# Altium project FMC_ADC.PrjPcb (part 1 of 4)
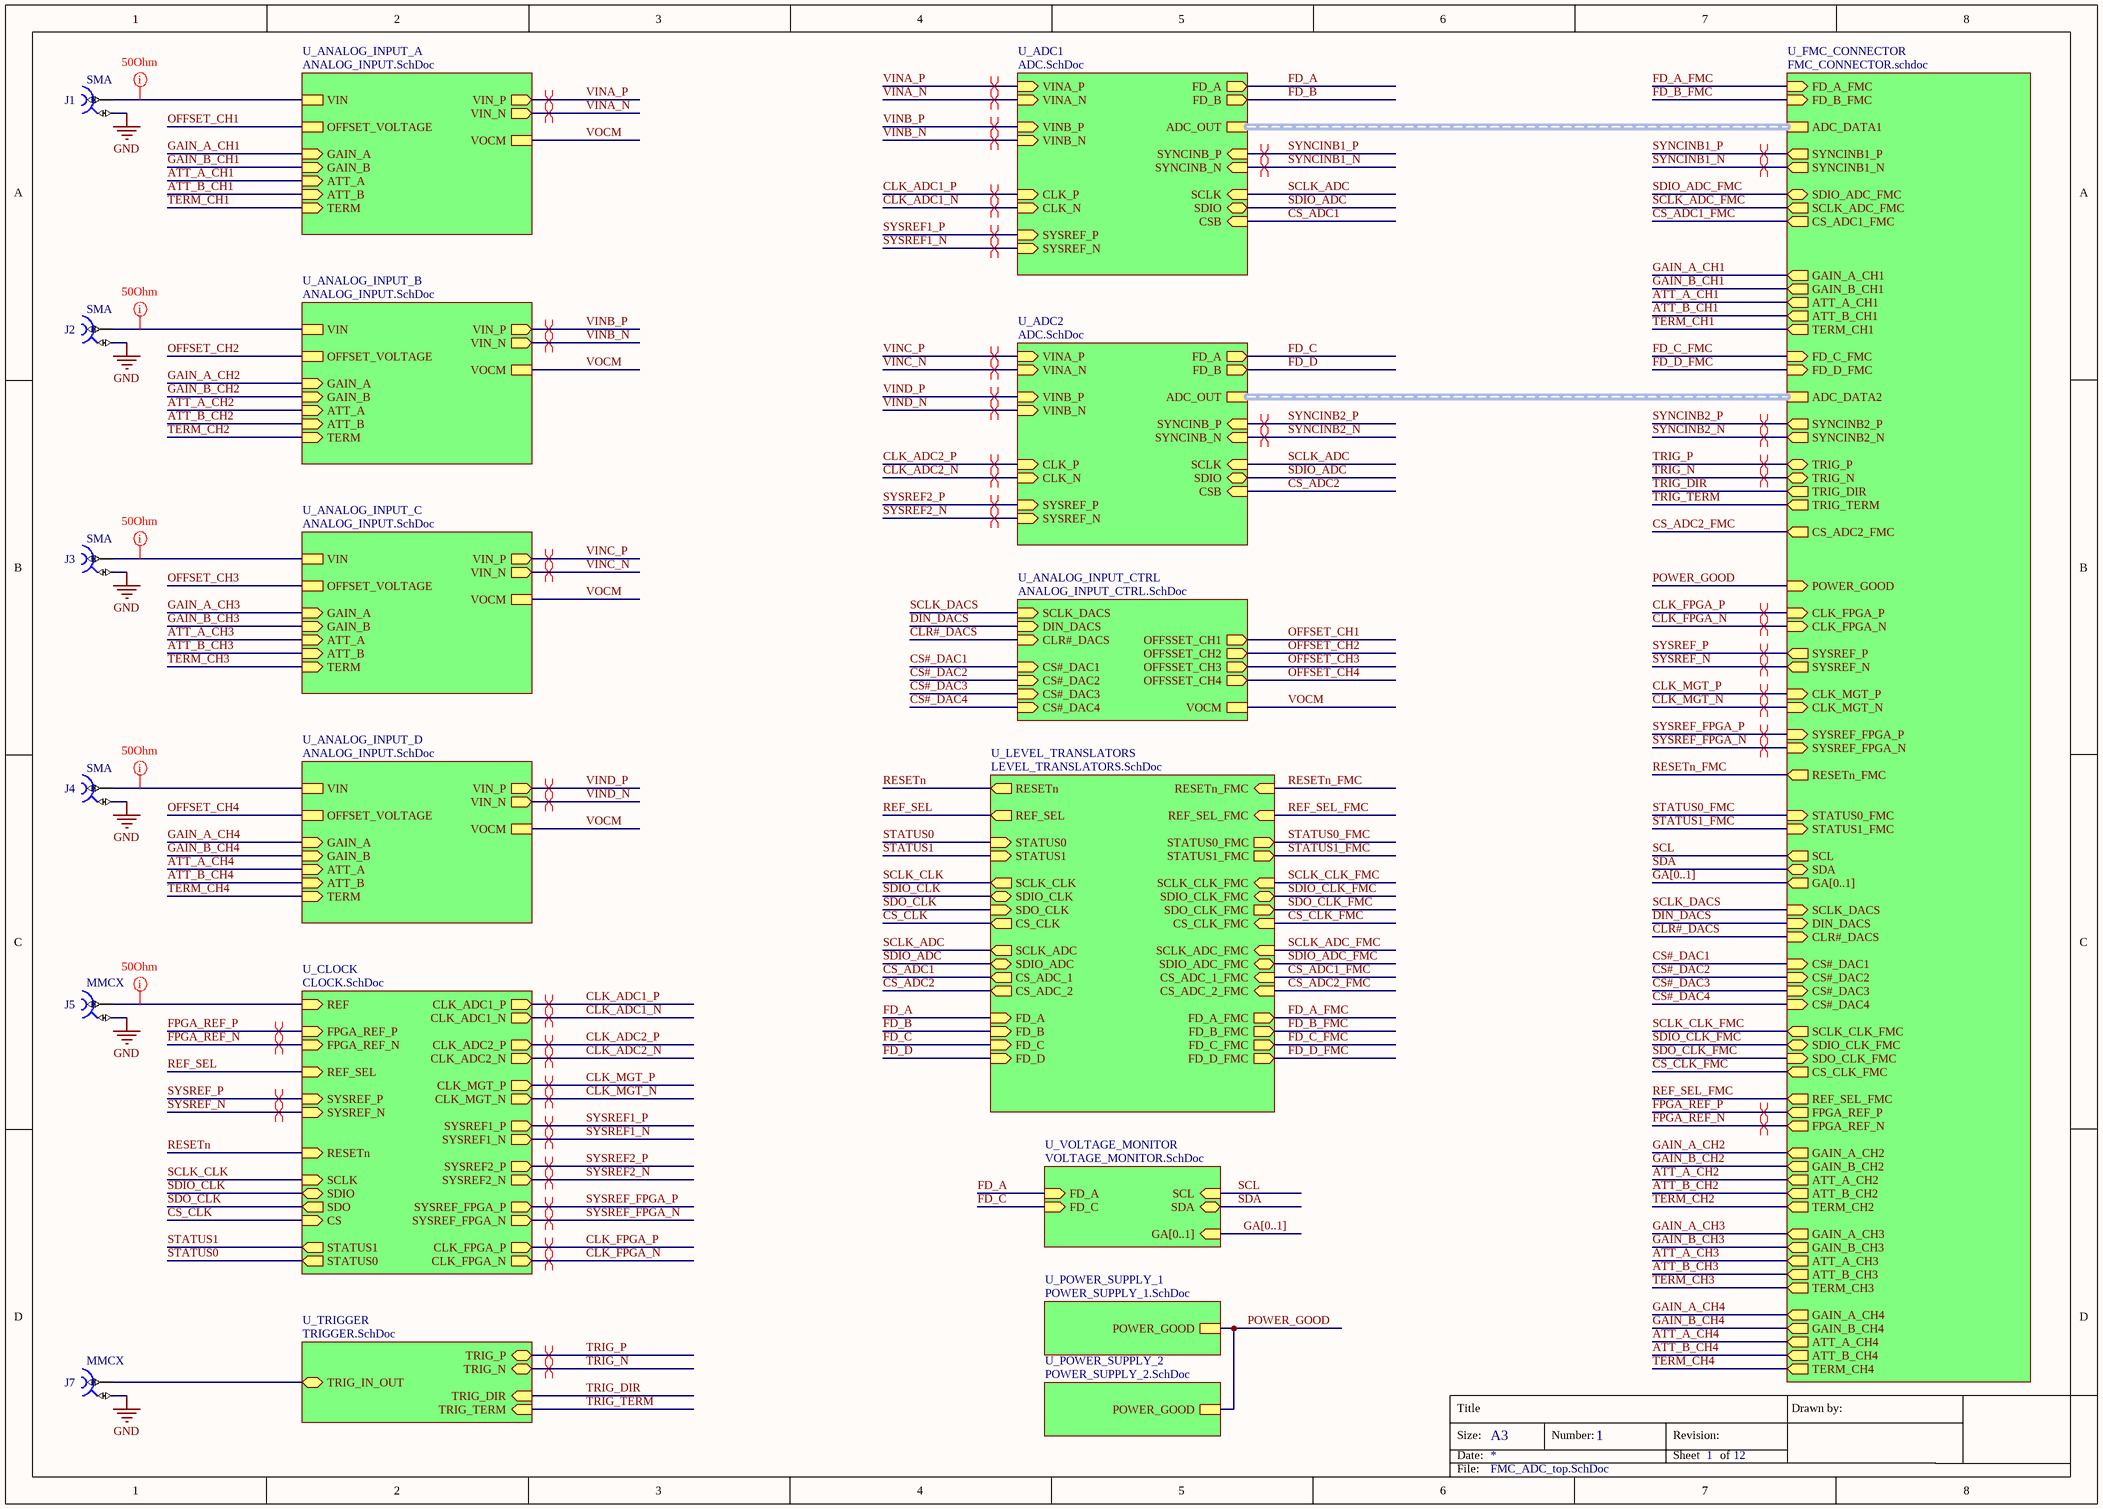
[diagram p0: FMC_ADC_top.SchDoc]
ProjectAddress1: Nowowiejska 15/19; ProjectAuthor: Wojciech Ruc³o; ProjectOrganization: Warsaw Univeristy of Technology; ProjectRevision: 1.0; ProjectTitle: FMC ADC 1G 4CH
12 sheets, 553 parts. Net scope: hierarchical (ports join the sheet entries above them; power ports are global).
Board file: FMC_ADC_Single.PCBDOC
Sheets:
  FMC_ADC_top.SchDoc
    U_FMC_CONNECTOR = FMC_CONNECTOR.schdoc
      U_CON_FMC_400PIN = CON_FMC_400PIN.SchDoc
    U_ADC2 = ADC.SchDoc
    U_CLOCK = CLOCK.SchDoc
    U_POWER_SUPPLY_1 = POWER_SUPPLY_1.SchDoc
    U_ANALOG_INPUT_D = ANALOG_INPUT.SchDoc
    U_ADC1 = ADC.SchDoc
    U_ANALOG_INPUT_C = ANALOG_INPUT.SchDoc
    U_ANALOG_INPUT_B = ANALOG_INPUT.SchDoc
    U_ANALOG_INPUT_A = ANALOG_INPUT.SchDoc
    U_LEVEL_TRANSLATORS = LEVEL_TRANSLATORS.SchDoc
    U_POWER_SUPPLY_2 = POWER_SUPPLY_2.SchDoc
    U_VOLTAGE_MONITOR = VOLTAGE_MONITOR.SchDoc
    U_TRIGGER = TRIGGER.SchDoc
    U_ANALOG_INPUT_CTRL = ANALOG_INPUT_CTRL.SchDoc

## Sheet FMC_ADC_top.SchDoc: =ProjectTitle
size A3; Author: Wojciech Ruc³o; Organization: Warsaw Univeristy of Technology; Address1: Nowowiejska 15/19; DocumentNumber: 1; Revision: 1.0; SheetNumber: 1; SheetTotal: 12

### Parts
J1  SMA  [HUBER-SUHNER_85_SMA-50-0-101/111_NE]
J2  SMA  [HUBER-SUHNER_85_SMA-50-0-101/111_NE]
J3  SMA  [HUBER-SUHNER_85_SMA-50-0-101/111_NE]
J4  SMA  [HUBER-SUHNER_85_SMA-50-0-101/111_NE]
J5  Family: MMCX  [HUBER-SUHNER_85_MMCX-50-0-1/111_OE]  (hidden comment: Coax_1Female_1Shield)
J7  Family: MMCX  [HUBER-SUHNER_85_MMCX-50-0-1/111_OE]  (hidden comment: Coax_1Female_1Shield)

### Sub-sheets
U_ADC1 = ADC.SchDoc: ADC_OUT (harness ADC_OUT), FD_A (out), FD_B (out), VINB_P (in), VINB_N (in), VINA_N (in), VINA_P (in), CLK_P (in), CLK_N (in), SYNCINB_N (in), SYSREF_P (in), SYNCINB_P (in), SYSREF_N (in), SDIO (bidir), SCLK (in), CSB (in)
U_ADC2 = ADC.SchDoc: ADC_OUT (harness ADC_OUT), FD_A (out), FD_B (out), VINB_P (in), VINB_N (in), VINA_N (in), VINA_P (in), CLK_P (in), CLK_N (in), SYNCINB_N (in), SYSREF_P (in), SYNCINB_P (in), SYSREF_N (in), SDIO (bidir), SCLK (in), CSB (in)
U_ANALOG_INPUT_A = ANALOG_INPUT.SchDoc: VIN_P (out), VIN_N (out), VIN, OFFSET_VOLTAGE, VOCM, GAIN_A (in), GAIN_B (in), ATT_B (in), ATT_A (in), TERM (in)
U_ANALOG_INPUT_B = ANALOG_INPUT.SchDoc: VIN_P (out), VIN_N (out), VIN, OFFSET_VOLTAGE, VOCM, GAIN_A (in), GAIN_B (in), ATT_B (in), ATT_A (in), TERM (in)
U_ANALOG_INPUT_C = ANALOG_INPUT.SchDoc: VIN_P (out), VIN_N (out), VIN, OFFSET_VOLTAGE, VOCM, GAIN_A (in), GAIN_B (in), ATT_B (in), ATT_A (in), TERM (in)
U_ANALOG_INPUT_CTRL = ANALOG_INPUT_CTRL.SchDoc: OFFSSET_CH1 (out), OFFSSET_CH2 (out), OFFSSET_CH3 (out), OFFSSET_CH4 (out), DIN_DACS (in), CS#_DAC1 (in), SCLK_DACS (in), CLR#_DACS (in), CS#_DAC2 (in), CS#_DAC3 (in), CS#_DAC4 (in), VOCM
U_ANALOG_INPUT_D = ANALOG_INPUT.SchDoc: VIN_P (out), VIN_N (out), VIN, OFFSET_VOLTAGE, VOCM, GAIN_A (in), GAIN_B (in), ATT_B (in), ATT_A (in), TERM (in)
U_CLOCK = CLOCK.SchDoc: REF (in), RESETn (in), SCLK (in), SDIO (bidir), CLK_FPGA_P (out), CLK_FPGA_N (out), CS (in), STATUS0 (out), STATUS1 (out), CLK_ADC1_P (out), CLK_ADC1_N (out), CLK_ADC2_P (out), CLK_ADC2_N (out), SDO (out), FPGA_REF_P (in), FPGA_REF_N (in), SYSREF_P (in), REF_SEL (in), SYSREF_N (in), SYSREF2_P (out), SYSREF1_P (out), SYSREF2_N (out), SYSREF1_N (out), SYSREF_FPGA_P (out), SYSREF_FPGA_N (out), CLK_MGT_N (out), CLK_MGT_P (out)
U_FMC_CONNECTOR = FMC_CONNECTOR.schdoc: ADC_DATA1 (harness ADC_OUT), SDIO_ADC_FMC (bidir), FD_A_FMC (in), SCLK_ADC_FMC (out), CS_ADC1_FMC (out), FD_B_FMC (in), SYSREF_P (out), SYSREF_N (out), CLK_MGT_P (in), SYSREF_FPGA_P (in), SYSREF_FPGA_N (in), CLK_MGT_N (in), SYNCINB1_P (out), SYNCINB1_N (out), SYNCINB2_N (out), SYNCINB2_P (out), ADC_DATA2 (harness ADC_OUT), STATUS0_FMC (in), RESETn_FMC (out), STATUS1_FMC (in), CS_CLK_FMC (out), FD_C_FMC (in), FD_D_FMC (in), CS_ADC2_FMC (out), CLK_FPGA_N (in), CLK_FPGA_P (in), SCL (out), SDA (bidir), GA[0..1] (out), TRIG_DIR (out), TRIG_P (bidir), TRIG_TERM (out), TRIG_N (bidir), CS#_DAC1 (in), SCLK_DACS (in), DIN_DACS (in), CLR#_DACS (in), CS#_DAC2 (in), CS#_DAC3 (in), CS#_DAC4 (in), SDIO_CLK_FMC (bidir), SCLK_CLK_FMC (out), SDO_CLK_FMC (in), REF_SEL_FMC (out), FPGA_REF_P (out), FPGA_REF_N (out), GAIN_A_CH1 (out), GAIN_B_CH1 (out), ATT_A_CH1 (out), ATT_B_CH1 (out), TERM_CH1 (out), GAIN_A_CH2 (out), GAIN_B_CH2 (out), ATT_A_CH2 (out), ATT_B_CH2 (out), TERM_CH2 (out), GAIN_A_CH3 (out), GAIN_B_CH3 (out), ATT_A_CH3 (out), ATT_B_CH3 (out), TERM_CH3 (out), GAIN_A_CH4 (out), GAIN_B_CH4 (out), ATT_A_CH4 (out), ATT_B_CH4 (out), TERM_CH4 (out), POWER_GOOD (in)
U_LEVEL_TRANSLATORS = LEVEL_TRANSLATORS.SchDoc: RESETn (out), CS_CLK (out), STATUS0 (in), STATUS1 (in), RESETn_FMC (in), STATUS0_FMC (out), STATUS1_FMC (out), CS_CLK_FMC (in), SCLK_CLK_FMC (in), SDIO_CLK_FMC (bidir), SCLK_CLK (out), SDIO_CLK (bidir), SDO_CLK (in), SDO_CLK_FMC (out), REF_SEL (out), REF_SEL_FMC (in), FD_C (in), FD_D (in), FD_A (in), FD_B (in), SCLK_ADC (out), SDIO_ADC (bidir), CS_ADC_1 (out), CS_ADC_2 (out), SCLK_ADC_FMC (in), SDIO_ADC_FMC (bidir), CS_ADC_1_FMC (in), CS_ADC_2_FMC (in), FD_C_FMC (out), FD_D_FMC (out), FD_A_FMC (out), FD_B_FMC (out)
U_POWER_SUPPLY_1 = POWER_SUPPLY_1.SchDoc: POWER_GOOD
U_POWER_SUPPLY_2 = POWER_SUPPLY_2.SchDoc: POWER_GOOD
U_TRIGGER = TRIGGER.SchDoc: TRIG_IN_OUT (bidir), TRIG_N (bidir), TRIG_P (bidir), TRIG_DIR (in), TRIG_TERM (in)
U_VOLTAGE_MONITOR = VOLTAGE_MONITOR.SchDoc: SDA (bidir), SCL (in), GA[0..1] (in), FD_A (in), FD_C (in)

### Nets
GND: J1.2 J2.2 J3.2 J4.2 J5.2 J7.2
ATT_A_CH1: sheet U_FMC_CONNECTOR/ATT_A_CH1, sheet U_ANALOG_INPUT_A/ATT_A
ATT_A_CH2: sheet U_FMC_CONNECTOR/ATT_A_CH2, sheet U_ANALOG_INPUT_B/ATT_A
ATT_A_CH3: sheet U_FMC_CONNECTOR/ATT_A_CH3, sheet U_ANALOG_INPUT_C/ATT_A
ATT_A_CH4: sheet U_FMC_CONNECTOR/ATT_A_CH4, sheet U_ANALOG_INPUT_D/ATT_A
ATT_B_CH1: sheet U_FMC_CONNECTOR/ATT_B_CH1, sheet U_ANALOG_INPUT_A/ATT_B
ATT_B_CH2: sheet U_FMC_CONNECTOR/ATT_B_CH2, sheet U_ANALOG_INPUT_B/ATT_B
ATT_B_CH3: sheet U_FMC_CONNECTOR/ATT_B_CH3, sheet U_ANALOG_INPUT_C/ATT_B
ATT_B_CH4: sheet U_FMC_CONNECTOR/ATT_B_CH4, sheet U_ANALOG_INPUT_D/ATT_B
CLK_ADC1_N: sheet U_CLOCK/CLK_ADC1_N, sheet U_ADC1/CLK_N
CLK_ADC1_P: sheet U_CLOCK/CLK_ADC1_P, sheet U_ADC1/CLK_P
CLK_ADC2_N: sheet U_ADC2/CLK_N, sheet U_CLOCK/CLK_ADC2_N
CLK_ADC2_P: sheet U_ADC2/CLK_P, sheet U_CLOCK/CLK_ADC2_P
CLK_FPGA_N: sheet U_FMC_CONNECTOR/CLK_FPGA_N, sheet U_CLOCK/CLK_FPGA_N
CLK_FPGA_P: sheet U_FMC_CONNECTOR/CLK_FPGA_P, sheet U_CLOCK/CLK_FPGA_P
CLK_MGT_N: sheet U_FMC_CONNECTOR/CLK_MGT_N, sheet U_CLOCK/CLK_MGT_N
CLK_MGT_P: sheet U_FMC_CONNECTOR/CLK_MGT_P, sheet U_CLOCK/CLK_MGT_P
CLR#_DACS: sheet U_FMC_CONNECTOR/CLR#_DACS, sheet U_ANALOG_INPUT_CTRL/CLR#_DACS
CS#_DAC1: sheet U_FMC_CONNECTOR/CS#_DAC1, sheet U_ANALOG_INPUT_CTRL/CS#_DAC1
CS#_DAC2: sheet U_FMC_CONNECTOR/CS#_DAC2, sheet U_ANALOG_INPUT_CTRL/CS#_DAC2
CS#_DAC3: sheet U_FMC_CONNECTOR/CS#_DAC3, sheet U_ANALOG_INPUT_CTRL/CS#_DAC3
CS#_DAC4: sheet U_FMC_CONNECTOR/CS#_DAC4, sheet U_ANALOG_INPUT_CTRL/CS#_DAC4
CS_ADC1: sheet U_ADC1/CSB, sheet U_LEVEL_TRANSLATORS/CS_ADC_1
CS_ADC1_FMC: sheet U_FMC_CONNECTOR/CS_ADC1_FMC, sheet U_LEVEL_TRANSLATORS/CS_ADC_1_FMC
CS_ADC2: sheet U_ADC2/CSB, sheet U_LEVEL_TRANSLATORS/CS_ADC_2
CS_ADC2_FMC: sheet U_FMC_CONNECTOR/CS_ADC2_FMC, sheet U_LEVEL_TRANSLATORS/CS_ADC_2_FMC
CS_CLK: sheet U_CLOCK/CS, sheet U_LEVEL_TRANSLATORS/CS_CLK
CS_CLK_FMC: sheet U_FMC_CONNECTOR/CS_CLK_FMC, sheet U_LEVEL_TRANSLATORS/CS_CLK_FMC
DIN_DACS: sheet U_FMC_CONNECTOR/DIN_DACS, sheet U_ANALOG_INPUT_CTRL/DIN_DACS
FD_A: sheet U_ADC1/FD_A, sheet U_LEVEL_TRANSLATORS/FD_A, sheet U_VOLTAGE_MONITOR/FD_A
FD_A_FMC: sheet U_FMC_CONNECTOR/FD_A_FMC, sheet U_LEVEL_TRANSLATORS/FD_A_FMC
FD_B: sheet U_ADC1/FD_B, sheet U_LEVEL_TRANSLATORS/FD_B
FD_B_FMC: sheet U_FMC_CONNECTOR/FD_B_FMC, sheet U_LEVEL_TRANSLATORS/FD_B_FMC
FD_C: sheet U_ADC2/FD_A, sheet U_LEVEL_TRANSLATORS/FD_C, sheet U_VOLTAGE_MONITOR/FD_C
FD_C_FMC: sheet U_FMC_CONNECTOR/FD_C_FMC, sheet U_LEVEL_TRANSLATORS/FD_C_FMC
FD_D: sheet U_ADC2/FD_B, sheet U_LEVEL_TRANSLATORS/FD_D
FD_D_FMC: sheet U_FMC_CONNECTOR/FD_D_FMC, sheet U_LEVEL_TRANSLATORS/FD_D_FMC
FPGA_REF_N: sheet U_FMC_CONNECTOR/FPGA_REF_N, sheet U_CLOCK/FPGA_REF_N
FPGA_REF_P: sheet U_FMC_CONNECTOR/FPGA_REF_P, sheet U_CLOCK/FPGA_REF_P
GAIN_A_CH1: sheet U_FMC_CONNECTOR/GAIN_A_CH1, sheet U_ANALOG_INPUT_A/GAIN_A
GAIN_A_CH2: sheet U_FMC_CONNECTOR/GAIN_A_CH2, sheet U_ANALOG_INPUT_B/GAIN_A
GAIN_A_CH3: sheet U_FMC_CONNECTOR/GAIN_A_CH3, sheet U_ANALOG_INPUT_C/GAIN_A
GAIN_A_CH4: sheet U_FMC_CONNECTOR/GAIN_A_CH4, sheet U_ANALOG_INPUT_D/GAIN_A
GAIN_B_CH1: sheet U_FMC_CONNECTOR/GAIN_B_CH1, sheet U_ANALOG_INPUT_A/GAIN_B
GAIN_B_CH2: sheet U_FMC_CONNECTOR/GAIN_B_CH2, sheet U_ANALOG_INPUT_B/GAIN_B
GAIN_B_CH3: sheet U_FMC_CONNECTOR/GAIN_B_CH3, sheet U_ANALOG_INPUT_C/GAIN_B
GAIN_B_CH4: sheet U_FMC_CONNECTOR/GAIN_B_CH4, sheet U_ANALOG_INPUT_D/GAIN_B
OFFSET_CH1: sheet U_ANALOG_INPUT_A/OFFSET_VOLTAGE, sheet U_ANALOG_INPUT_CTRL/OFFSSET_CH1
OFFSET_CH2: sheet U_ANALOG_INPUT_B/OFFSET_VOLTAGE, sheet U_ANALOG_INPUT_CTRL/OFFSSET_CH2
OFFSET_CH3: sheet U_ANALOG_INPUT_C/OFFSET_VOLTAGE, sheet U_ANALOG_INPUT_CTRL/OFFSSET_CH3
OFFSET_CH4: sheet U_ANALOG_INPUT_D/OFFSET_VOLTAGE, sheet U_ANALOG_INPUT_CTRL/OFFSSET_CH4
POWER_GOOD: sheet U_FMC_CONNECTOR/POWER_GOOD, sheet U_POWER_SUPPLY_1/POWER_GOOD, sheet U_POWER_SUPPLY_2/POWER_GOOD
REF_SEL: sheet U_CLOCK/REF_SEL, sheet U_LEVEL_TRANSLATORS/REF_SEL
REF_SEL_FMC: sheet U_FMC_CONNECTOR/REF_SEL_FMC, sheet U_LEVEL_TRANSLATORS/REF_SEL_FMC  [project net LA16_P]
RESETn: sheet U_CLOCK/RESETn, sheet U_LEVEL_TRANSLATORS/RESETn
RESETn_FMC: sheet U_FMC_CONNECTOR/RESETn_FMC, sheet U_LEVEL_TRANSLATORS/RESETn_FMC  [project net LA14_P]
SCL: sheet U_FMC_CONNECTOR/SCL, sheet U_VOLTAGE_MONITOR/SCL
SCLK_ADC: sheet U_ADC2/SCLK, sheet U_ADC1/SCLK, sheet U_LEVEL_TRANSLATORS/SCLK_ADC
SCLK_ADC_FMC: sheet U_FMC_CONNECTOR/SCLK_ADC_FMC, sheet U_LEVEL_TRANSLATORS/SCLK_ADC_FMC  [project net LA33_N]
SCLK_CLK: sheet U_CLOCK/SCLK, sheet U_LEVEL_TRANSLATORS/SCLK_CLK
SCLK_CLK_FMC: sheet U_FMC_CONNECTOR/SCLK_CLK_FMC, sheet U_LEVEL_TRANSLATORS/SCLK_CLK_FMC  [project net LA15_N]
SCLK_DACS: sheet U_FMC_CONNECTOR/SCLK_DACS, sheet U_ANALOG_INPUT_CTRL/SCLK_DACS  [project net LA02_P]
SDA: sheet U_FMC_CONNECTOR/SDA, sheet U_VOLTAGE_MONITOR/SDA
SDIO_ADC: sheet U_ADC2/SDIO, sheet U_ADC1/SDIO, sheet U_LEVEL_TRANSLATORS/SDIO_ADC
SDIO_ADC_FMC: sheet U_FMC_CONNECTOR/SDIO_ADC_FMC, sheet U_LEVEL_TRANSLATORS/SDIO_ADC_FMC  [project net LA32_P]
SDIO_CLK: sheet U_CLOCK/SDIO, sheet U_LEVEL_TRANSLATORS/SDIO_CLK
SDIO_CLK_FMC: sheet U_FMC_CONNECTOR/SDIO_CLK_FMC, sheet U_LEVEL_TRANSLATORS/SDIO_CLK_FMC  [project net LA14_N]
SDO_CLK: sheet U_CLOCK/SDO, sheet U_LEVEL_TRANSLATORS/SDO_CLK
SDO_CLK_FMC: sheet U_FMC_CONNECTOR/SDO_CLK_FMC, sheet U_LEVEL_TRANSLATORS/SDO_CLK_FMC  [project net LA19_P]
STATUS0: sheet U_CLOCK/STATUS0, sheet U_LEVEL_TRANSLATORS/STATUS0
STATUS0_FMC: sheet U_FMC_CONNECTOR/STATUS0_FMC, sheet U_LEVEL_TRANSLATORS/STATUS0_FMC  [project net LA15_P]
STATUS1: sheet U_CLOCK/STATUS1, sheet U_LEVEL_TRANSLATORS/STATUS1
STATUS1_FMC: sheet U_FMC_CONNECTOR/STATUS1_FMC, sheet U_LEVEL_TRANSLATORS/STATUS1_FMC  [project net LA13_N]
SYNCINB1_N: sheet U_FMC_CONNECTOR/SYNCINB1_N, sheet U_ADC1/SYNCINB_N  [project net LA30_N]
SYNCINB1_P: sheet U_FMC_CONNECTOR/SYNCINB1_P, sheet U_ADC1/SYNCINB_P  [project net LA30_P]
SYNCINB2_N: sheet U_FMC_CONNECTOR/SYNCINB2_N, sheet U_ADC2/SYNCINB_N  [project net LA03_N]
SYNCINB2_P: sheet U_FMC_CONNECTOR/SYNCINB2_P, sheet U_ADC2/SYNCINB_P  [project net LA03_P]
SYSREF1_N: sheet U_CLOCK/SYSREF1_N, sheet U_ADC1/SYSREF_N
SYSREF1_P: sheet U_CLOCK/SYSREF1_P, sheet U_ADC1/SYSREF_P
SYSREF2_N: sheet U_ADC2/SYSREF_N, sheet U_CLOCK/SYSREF2_N
SYSREF2_P: sheet U_ADC2/SYSREF_P, sheet U_CLOCK/SYSREF2_P
SYSREF_FPGA_N: sheet U_FMC_CONNECTOR/SYSREF_FPGA_N, sheet U_CLOCK/SYSREF_FPGA_N  [project net LA01_CC_N]
SYSREF_FPGA_P: sheet U_FMC_CONNECTOR/SYSREF_FPGA_P, sheet U_CLOCK/SYSREF_FPGA_P  [project net LA01_CC_P]
SYSREF_N: sheet U_FMC_CONNECTOR/SYSREF_N, sheet U_CLOCK/SYSREF_N  [project net LA00_CC_N]
SYSREF_P: sheet U_FMC_CONNECTOR/SYSREF_P, sheet U_CLOCK/SYSREF_P  [project net LA00_CC_P]
TERM_CH1: sheet U_FMC_CONNECTOR/TERM_CH1, sheet U_ANALOG_INPUT_A/TERM  [project net LA26_P]
TERM_CH2: sheet U_FMC_CONNECTOR/TERM_CH2, sheet U_ANALOG_INPUT_B/TERM  [project net LA25_N]
TERM_CH3: sheet U_FMC_CONNECTOR/TERM_CH3, sheet U_ANALOG_INPUT_C/TERM  [project net LA09_P]
TERM_CH4: sheet U_FMC_CONNECTOR/TERM_CH4, sheet U_ANALOG_INPUT_D/TERM  [project net LA06_N]
TRIG_DIR: sheet U_FMC_CONNECTOR/TRIG_DIR, sheet U_TRIGGER/TRIG_DIR  [project net LA22_P]
TRIG_N: sheet U_FMC_CONNECTOR/TRIG_N, sheet U_TRIGGER/TRIG_N  [project net LA11_N]
TRIG_P: sheet U_FMC_CONNECTOR/TRIG_P, sheet U_TRIGGER/TRIG_P  [project net LA11_P]
TRIG_TERM: sheet U_FMC_CONNECTOR/TRIG_TERM, sheet U_TRIGGER/TRIG_TERM  [project net LA27_N]
VINA_N: sheet U_ADC1/VINA_N, sheet U_ANALOG_INPUT_A/VIN_N
VINA_P: sheet U_ADC1/VINA_P, sheet U_ANALOG_INPUT_A/VIN_P
VINB_N: sheet U_ADC1/VINB_N, sheet U_ANALOG_INPUT_B/VIN_N
VINB_P: sheet U_ADC1/VINB_P, sheet U_ANALOG_INPUT_B/VIN_P
VINC_N: sheet U_ADC2/VINA_N, sheet U_ANALOG_INPUT_C/VIN_N
VINC_P: sheet U_ADC2/VINA_P, sheet U_ANALOG_INPUT_C/VIN_P
VIND_N: sheet U_ADC2/VINB_N, sheet U_ANALOG_INPUT_D/VIN_N
VIND_P: sheet U_ADC2/VINB_P, sheet U_ANALOG_INPUT_D/VIN_P
VOCM: sheet U_ANALOG_INPUT_D/VOCM, sheet U_ANALOG_INPUT_C/VOCM, sheet U_ANALOG_INPUT_B/VOCM, sheet U_ANALOG_INPUT_A/VOCM, sheet U_ANALOG_INPUT_CTRL/VOCM
NetC246_1: J5.1 ; sheet U_CLOCK/REF
NetD1_3: J7.1 ; sheet U_TRIGGER/TRIG_IN_OUT
NetJ1_1: J1.1 ; sheet U_ANALOG_INPUT_A/VIN
NetJ2_1: J2.1 ; sheet U_ANALOG_INPUT_B/VIN
NetJ3_1: J3.1 ; sheet U_ANALOG_INPUT_C/VIN
NetJ4_1: J4.1 ; sheet U_ANALOG_INPUT_D/VIN

### Buses and harness runs
bus GA[0..1] = sheet U_FMC_CONNECTOR/GA[0..1]
bus GA[0..1] = sheet U_VOLTAGE_MONITOR/GA[0..1]
harness sheet U_ADC1/ADC_OUT = sheet U_FMC_CONNECTOR/ADC_DATA1
harness sheet U_ADC2/ADC_OUT = sheet U_FMC_CONNECTOR/ADC_DATA2

### Layout directives
differential pair: CLK_ADC1_N, CLK_ADC1_P, CLK_ADC2_N, CLK_ADC2_P, CLK_FPGA_N, CLK_FPGA_P, CLK_MGT_N, CLK_MGT_P, FPGA_REF_N, FPGA_REF_P, LA00_CC_N, LA00_CC_P, LA01_CC_N, LA01_CC_P, LA03_N, LA03_P, LA11_N, LA11_P, LA30_N, LA30_P, SYSREF1_N, SYSREF1_P, SYSREF2_N, SYSREF2_P, VINA_N, VINA_P, VINB_N, VINB_P, VINC_N, VINC_P, VIND_N, VIND_P
net class 50Ohm: NetC246_1, NetJ1_1, NetJ2_1, NetJ3_1, NetJ4_1

### Notes on the sheet
- Title
- Size:
- Date:
- A3
- Number:
- Revision:
- Sheet
- of
- Drawn by:
- File:

### Library data of the parts
J1-J4 = HUBER-SUHNER_85_SMA-50-0-101/111_NE: Part Description: SMA 50 Ohms Right Angle PCB Jack; Manufacturer: HUBER+SUHNER; PressFit: No; Part Number: HUBER-SUHNER_85_SMA-50-0-101/111_NE; Component Kind: Standard; Component Type: Standard; Footprint: HUBER-SUHNER_85 SMA-50-0-101/111_NE; Pin Count: 2; Family: SMA; Mounted: Yes; Socket: No; SMD: No; Sense: No; Status: None; Manufacturer Part Number: 85_SMA-50-0-101/111_NE; ComponentHeight: 9.6mm; HelpURL: \\cern.ch\dfs\Applications\Altium\Datasheets\HUBER-SUHNER_85_SMA-50-0-101-111_NE.pdf; Author: CERN DEM JLC; CreateDate: 20.04.2010; LatestRevisionDate: 06.11.2014
J5 J7 = HUBER-SUHNER_85_MMCX-50-0-1/111_OE: Part Description: MMCX 50 Ohms Right Angle PCB Jack; Manufacturer: HUBER+SUHNER; PressFit: No; Part Number: HUBER-SUHNER_85_MMCX-50-0-1/111_OE; Component Kind: Standard; Component Type: Standard; Pin Count: 2; Mounted: Yes; Socket: No; SMD: No; Sense: No; Status: None; Manufacturer Part Number: 85_MMCX-50-0-1/111_OE; ComponentHeight: 9.6mm; HelpURL: \\cern.ch\dfs\Applications\Altium\Datasheets\HUBER-SUHNER_85_MMCX-50-0-1-111_OE.pdf; Author: CERN DEM JLC; CreateDate: 06.11.2014; LatestRevisionDate: 06.11.2014

## Sheet FMC_CONNECTOR.schdoc: FMC Connector
size A3; Author: Wojciech Ruc³o; Organization: Warsaw Univeristy of Technology; Address1: Nowowiejska 15/19; DocumentNumber: 6; Revision: 1.0; SheetNumber: 6; SheetTotal: 12
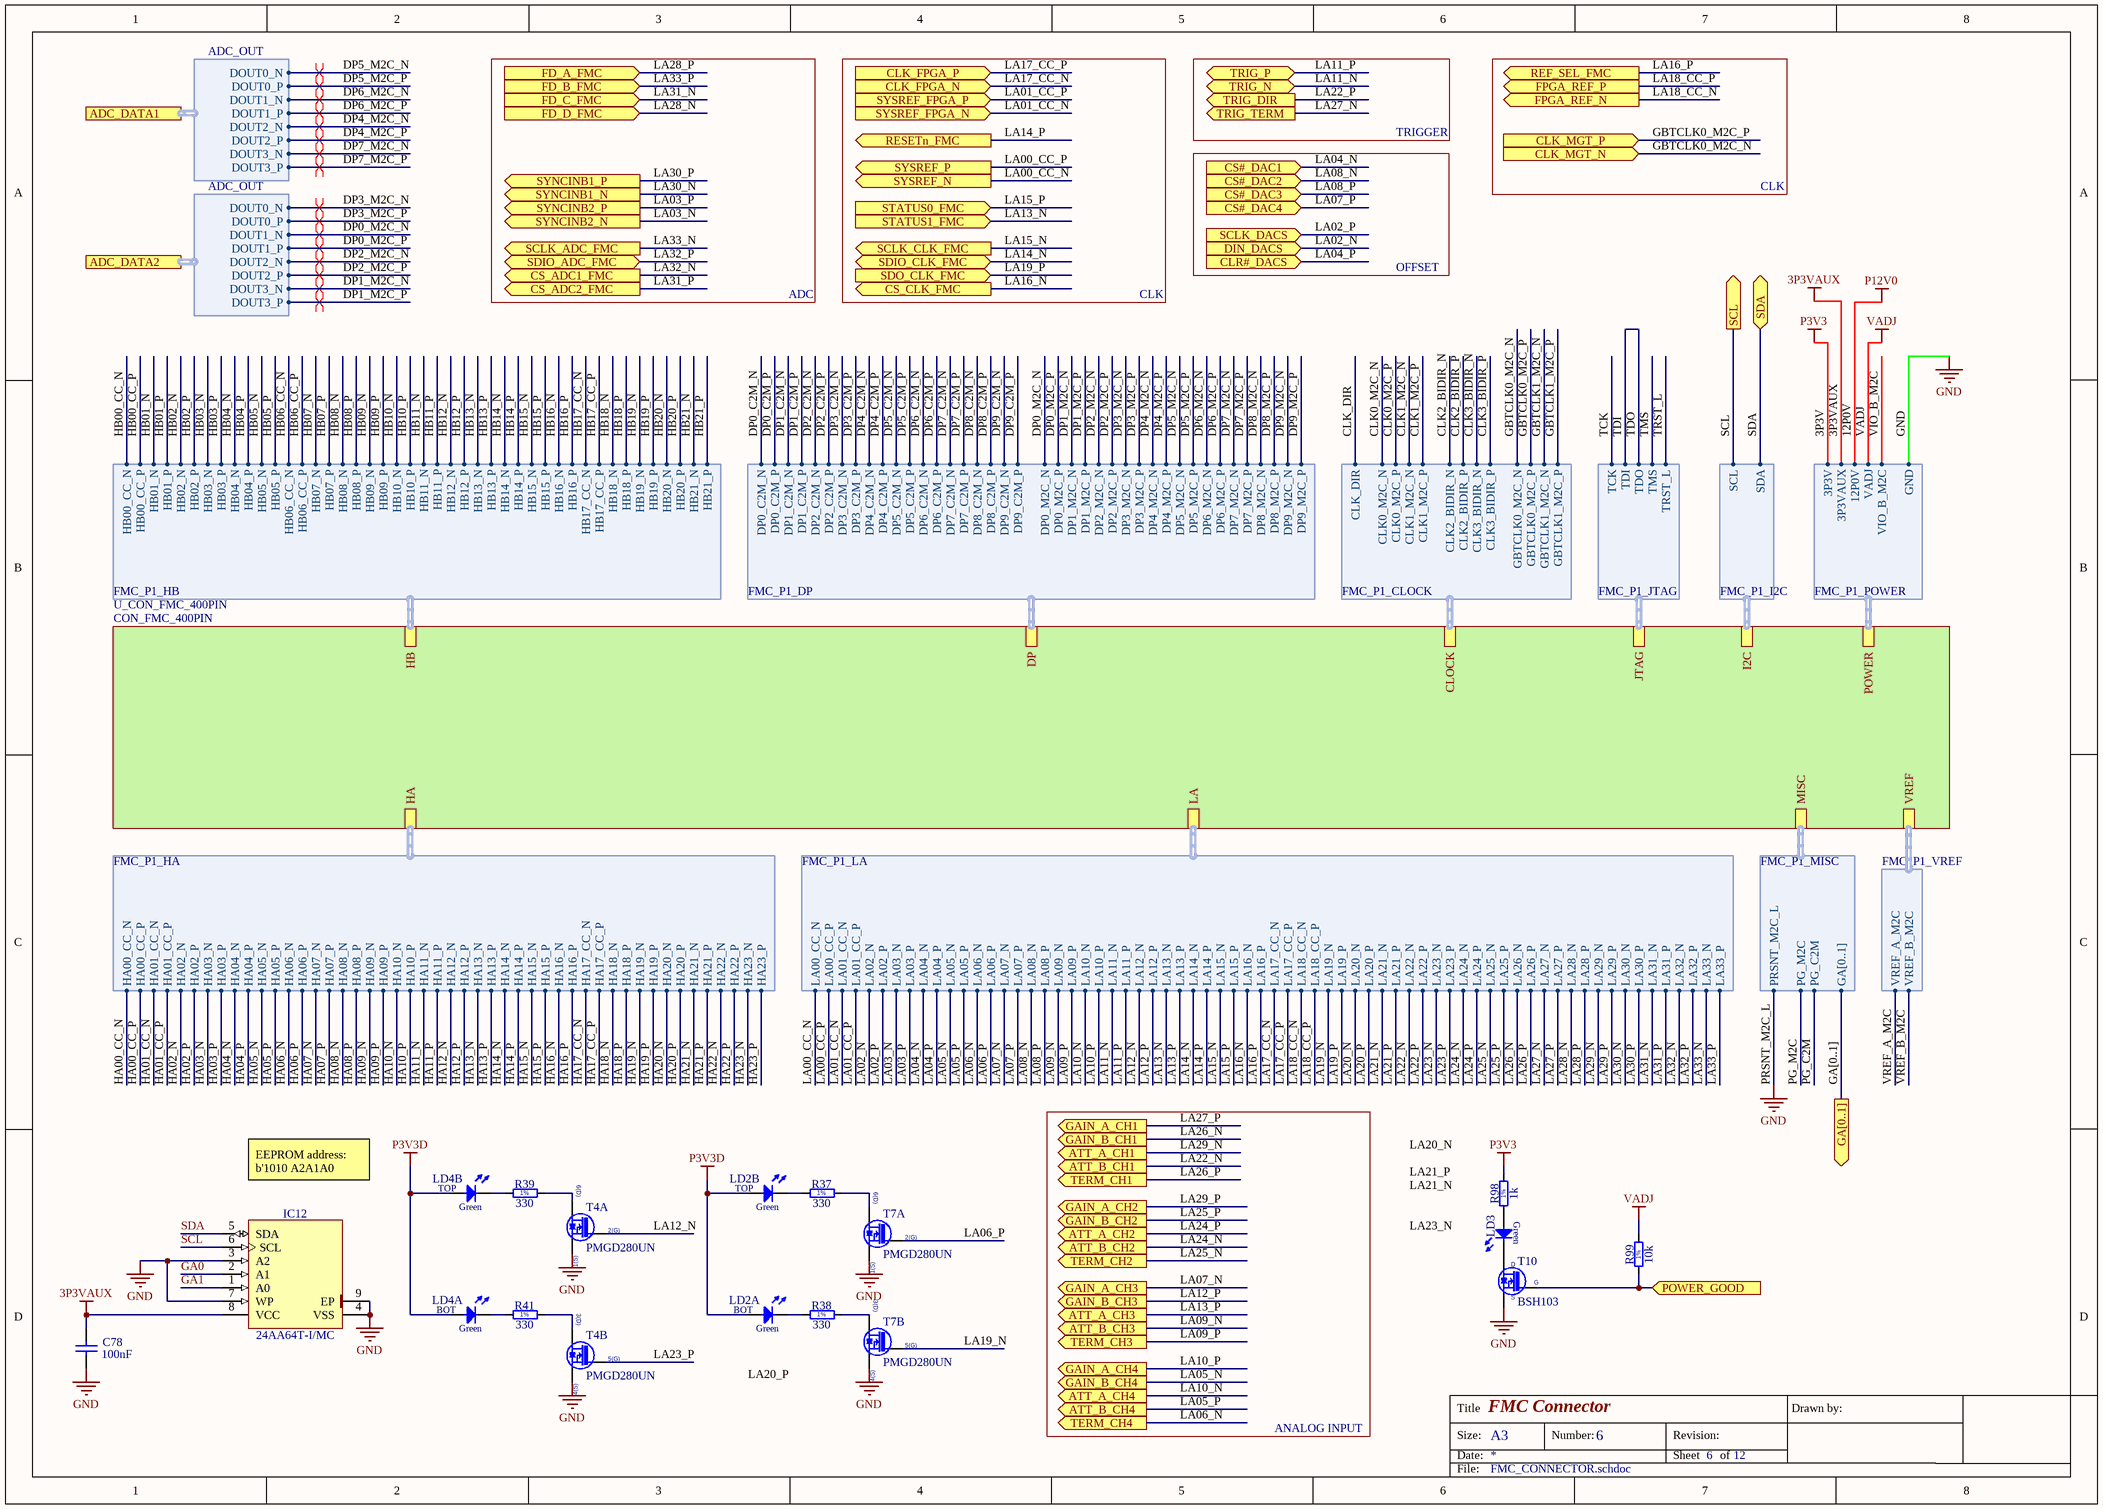
[diagram p1: FMC_CONNECTOR.schdoc]

### Parts
C78  100nF  [CAPC0603X33N]
IC12  24AA64T-I/MC  [SON50P300X200X100-9N-R175X155]
LD2  (no value)  [553-xxxx-300]  (parts A,B of 2)
LD3  (no value)  [LED0603X65N]
LD4  (no value)  [553-xxxx-300]  (parts A,B of 2)
R37  330  [RESC1005X40N]
R38  330  [RESC1005X40N]
R39  330  [RESC1005X40N]
R41  330  [RESC1005X40N]
R98  1k  [RESC1005X40N]
R99  10k  [RESC1608X55N]
T4  PMGD280UN  [SOT65P210X110-6N]  (parts A,B of 2)
T7  PMGD280UN  [SOT65P210X110-6N]  (parts A,B of 2)
T10  BSH103  [SOT95P230X110-3N]

### Sub-sheets
U_CON_FMC_400PIN = CON_FMC_400PIN: LA (harness FMC_P1_LA), HA (harness FMC_P1_HA), HB (harness FMC_P1_HB), MISC (harness FMC_P1_MISC), POWER (harness FMC_P1_POWER), JTAG (harness FMC_P1_JTAG), I2C (harness FMC_P1_I2C), CLOCK (harness FMC_P1_CLOCK), VREF (harness FMC_P1_VREF), DP (harness FMC_P1_DP)

### Ports
ADC_DATA1 (harness ADC_OUT), ADC_DATA2 (harness ADC_OUT), ATT_A_CH1 (out), ATT_A_CH2 (out), ATT_A_CH3 (out), ATT_A_CH4 (out), ATT_B_CH1 (out), ATT_B_CH2 (out), ATT_B_CH3 (out), ATT_B_CH4 (out), CLK_FPGA_N (in), CLK_FPGA_P (in), CLK_MGT_N (in), CLK_MGT_P (in), CLR#_DACS (in), CS#_DAC1 (in), CS#_DAC2 (in), CS#_DAC3 (in), CS#_DAC4 (in), CS_ADC1_FMC (out), CS_ADC2_FMC (out), CS_CLK_FMC (out), DIN_DACS (in), FD_A_FMC (in), FD_B_FMC (in), FD_C_FMC (in), FD_D_FMC (in), FPGA_REF_N (out), FPGA_REF_P (out), GA[0..1] (out), GAIN_A_CH1 (out), GAIN_A_CH2 (out), GAIN_A_CH3 (out), GAIN_A_CH4 (out), GAIN_B_CH1 (out), GAIN_B_CH2 (out), GAIN_B_CH3 (out), GAIN_B_CH4 (out), POWER_GOOD (in), REF_SEL_FMC (out), RESETn_FMC (out), SCL (out), SCLK_ADC_FMC (out), SCLK_CLK_FMC (out), SCLK_DACS (in), SDA (bidir), SDIO_ADC_FMC (bidir), SDIO_CLK_FMC (bidir), SDO_CLK_FMC (in), STATUS0_FMC (in), STATUS1_FMC (in), SYNCINB1_N (out), SYNCINB1_P (out), SYNCINB2_N (out), SYNCINB2_P (out), SYSREF_FPGA_N (in), SYSREF_FPGA_P (in), SYSREF_N (out), SYSREF_P (out), TERM_CH1 (out), TERM_CH2 (out), TERM_CH3 (out), TERM_CH4 (out), TRIG_DIR (out), TRIG_N (bidir), TRIG_P (bidir), TRIG_TERM (out)

### Harnesses
FMC_P1_DP: DP1_C2M_N, DP1_C2M_P, DP1_M2C_N, DP1_M2C_P, DP2_C2M_N, DP2_C2M_P, DP2_M2C_N, DP2_M2C_P, DP3_C2M_N, DP3_C2M_P, DP3_M2C_N, DP3_M2C_P, DP4_C2M_N, DP4_C2M_P, DP4_M2C_N, DP4_M2C_P, DP5_C2M_N, DP5_C2M_P, DP5_M2C_N, DP5_M2C_P, DP6_C2M_N, DP6_C2M_P, DP6_M2C_N, DP6_M2C_P, DP7_C2M_N, DP7_C2M_P, DP7_M2C_N, DP7_M2C_P, DP8_C2M_N, DP8_C2M_P, DP8_M2C_N, DP8_M2C_P, DP9_C2M_N, DP9_C2M_P, DP9_M2C_N, DP9_M2C_P, DP0_C2M_N, DP0_C2M_P, DP0_M2C_N, DP0_M2C_P
FMC_P1_MISC: PRSNT_M2C_L, PG_M2C, PG_C2M, GA[0..1]
FMC_P1_POWER: 3P3V, 3P3VAUX, 12P0V, VADJ, VIO_B_M2C, GND
FMC_P1_JTAG: TCK, TDI, TDO, TMS, TRST_L
FMC_P1_I2C: SCL, SDA
FMC_P1_CLOCK: CLK2_BIDIR_N, CLK2_BIDIR_P, CLK3_BIDIR_N, CLK3_BIDIR_P, CLK0_M2C_N, CLK0_M2C_P, CLK1_M2C_N, CLK1_M2C_P, CLK_DIR, GBTCLK0_M2C_N, GBTCLK0_M2C_P, GBTCLK1_M2C_N, GBTCLK1_M2C_P
FMC_P1_VREF: VREF_A_M2C, VREF_B_M2C
FMC_P1_HA: HA04_N, HA04_P, HA05_N, HA05_P, HA08_N, HA08_P, HA09_N, HA09_P, HA12_N, HA12_P, HA13_N, HA13_P, HA15_N, HA15_P, HA16_N, HA16_P, HA19_N, HA19_P, HA20_N, HA20_P, HA02_N, HA02_P, HA03_N, HA03_P, HA06_N, HA06_P, HA07_N, HA07_P, HA10_N, HA10_P, HA11_N, HA11_P, HA14_N, HA14_P, HA18_N, HA18_P, HA21_N, HA21_P, HA22_N, HA22_P, HA23_N, HA23_P, HA17_CC_N, HA17_CC_P, HA00_CC_N, HA00_CC_P, HA01_CC_N, HA01_CC_P
FMC_P1_LA: LA05_N, LA05_P, LA06_N, LA06_P, LA09_N, LA09_P, LA10_N, LA10_P, LA13_N, LA13_P, LA14_N, LA14_P, LA23_N, LA23_P, LA26_N, LA26_P, LA27_N, LA27_P, LA02_N, LA02_P, LA03_N, LA03_P, LA04_N, LA04_P, LA07_N, LA07_P, LA08_N, LA08_P, LA11_N, LA11_P, LA12_N, LA12_P, LA15_N, LA15_P, LA16_N, LA16_P, LA19_N, LA19_P, LA20_N, LA20_P, LA21_N, LA21_P, LA22_N, LA22_P, LA24_N, LA24_P, LA25_N, LA25_P, LA28_N, LA28_P, LA29_N, LA29_P, LA30_N, LA30_P, LA31_N, LA31_P, LA32_N, LA32_P, LA33_N, LA33_P, LA00_CC_N, LA00_CC_P, LA01_CC_N, LA01_CC_P, LA17_CC_N, LA17_CC_P, LA18_CC_N, LA18_CC_P
FMC_P1_HB: HB02_N, HB02_P, HB03_N, HB03_P, HB04_N, HB04_P, HB05_N, HB05_P, HB08_N, HB08_P, HB09_N, HB09_P, HB12_N, HB12_P, HB13_N, HB13_P, HB16_N, HB16_P, HB19_N, HB19_P, HB20_N, HB20_P, HB21_N, HB21_P, HB01_N, HB01_P, HB07_N, HB07_P, HB10_N, HB10_P, HB11_N, HB11_P, HB14_N, HB14_P, HB15_N, HB15_P, HB18_N, HB18_P, HB17_CC_N, HB17_CC_P, HB06_CC_N, HB06_CC_P, HB00_CC_N, HB00_CC_P
ADC_OUT: DOUT0_N, DOUT0_P, DOUT1_N, DOUT1_P, DOUT2_N, DOUT2_P, DOUT3_N, DOUT3_P

### Nets
3P3V: R98.2 ; sheet U_CON_FMC_400PIN/POWER.3P3V  [also labelled P3V3]
3P3VAUX: C78.2 IC12.8(VCC) ; sheet U_CON_FMC_400PIN/POWER.3P3VAUX
GND: C78.1 IC12.3(A2) IC12.4(VSS) IC12.7(WP) IC12.9(EP) T4.1(S) T4.4(S) T7.1(S) T7.4(S) T10.2(S) ; sheet U_CON_FMC_400PIN/MISC.PRSNT_M2C_L, sheet U_CON_FMC_400PIN/POWER.GND  [also labelled PRSNT_M2C_L]
P3V3D: LD2.2(A) LD2.4(A) LD4.2(A) LD4.4(A)
VADJ: R99.2 ; sheet U_CON_FMC_400PIN/POWER.VADJ
DP0_M2C_N: sheet U_CON_FMC_400PIN/DP.DP0_M2C_N, port ADC_DATA2.DOUT1_N
DP0_M2C_P: sheet U_CON_FMC_400PIN/DP.DP0_M2C_P, port ADC_DATA2.DOUT1_P
DP1_M2C_N: sheet U_CON_FMC_400PIN/DP.DP1_M2C_N, port ADC_DATA2.DOUT3_N
DP1_M2C_P: sheet U_CON_FMC_400PIN/DP.DP1_M2C_P, port ADC_DATA2.DOUT3_P
DP2_M2C_N: sheet U_CON_FMC_400PIN/DP.DP2_M2C_N, port ADC_DATA2.DOUT2_N
DP2_M2C_P: sheet U_CON_FMC_400PIN/DP.DP2_M2C_P, port ADC_DATA2.DOUT2_P
DP3_M2C_N: sheet U_CON_FMC_400PIN/DP.DP3_M2C_N, port ADC_DATA2.DOUT0_N
DP3_M2C_P: sheet U_CON_FMC_400PIN/DP.DP3_M2C_P, port ADC_DATA2.DOUT0_P
DP4_M2C_N: sheet U_CON_FMC_400PIN/DP.DP4_M2C_N, port ADC_DATA1.DOUT2_N
DP4_M2C_P: sheet U_CON_FMC_400PIN/DP.DP4_M2C_P, port ADC_DATA1.DOUT2_P
DP5_M2C_N: sheet U_CON_FMC_400PIN/DP.DP5_M2C_N, port ADC_DATA1.DOUT0_N
DP5_M2C_P: sheet U_CON_FMC_400PIN/DP.DP5_M2C_P, port ADC_DATA1.DOUT0_P
DP6_M2C_N: sheet U_CON_FMC_400PIN/DP.DP6_M2C_N, port ADC_DATA1.DOUT1_N
DP6_M2C_P: sheet U_CON_FMC_400PIN/DP.DP6_M2C_P, port ADC_DATA1.DOUT1_P
DP7_M2C_N: sheet U_CON_FMC_400PIN/DP.DP7_M2C_N, port ADC_DATA1.DOUT3_N
DP7_M2C_P: sheet U_CON_FMC_400PIN/DP.DP7_M2C_P, port ADC_DATA1.DOUT3_P
GA0: IC12.2(A1)
GA1: IC12.1(A0)
GBTCLK0_M2C_N: port CLK_MGT_N, sheet U_CON_FMC_400PIN/CLOCK.GBTCLK0_M2C_N  [project net CLK_MGT_N]
GBTCLK0_M2C_P: port CLK_MGT_P, sheet U_CON_FMC_400PIN/CLOCK.GBTCLK0_M2C_P  [project net CLK_MGT_P]
LA00_CC_N: port SYSREF_N, sheet U_CON_FMC_400PIN/LA.LA00_CC_N
LA00_CC_P: port SYSREF_P, sheet U_CON_FMC_400PIN/LA.LA00_CC_P
LA01_CC_N: port SYSREF_FPGA_N, sheet U_CON_FMC_400PIN/LA.LA01_CC_N
LA01_CC_P: port SYSREF_FPGA_P, sheet U_CON_FMC_400PIN/LA.LA01_CC_P
LA02_N: port DIN_DACS, sheet U_CON_FMC_400PIN/LA.LA02_N  [project net DIN_DACS]
LA02_P: port SCLK_DACS, sheet U_CON_FMC_400PIN/LA.LA02_P
LA03_N: port SYNCINB2_N, sheet U_CON_FMC_400PIN/LA.LA03_N
LA03_P: port SYNCINB2_P, sheet U_CON_FMC_400PIN/LA.LA03_P
LA04_N: port CS#_DAC1, sheet U_CON_FMC_400PIN/LA.LA04_N  [project net CS#_DAC1]
LA04_P: port CLR#_DACS, sheet U_CON_FMC_400PIN/LA.LA04_P  [project net CLR#_DACS]
LA05_N: port GAIN_B_CH4, sheet U_CON_FMC_400PIN/LA.LA05_N  [project net GAIN_B_CH4]
LA05_P: port ATT_B_CH4, sheet U_CON_FMC_400PIN/LA.LA05_P  [project net ATT_B_CH4]
LA06_N: port TERM_CH4, sheet U_CON_FMC_400PIN/LA.LA06_N
LA06_P: T7.2(G) ; sheet U_CON_FMC_400PIN/LA.LA06_P
LA07_N: port GAIN_A_CH3, sheet U_CON_FMC_400PIN/LA.LA07_N  [project net GAIN_A_CH3]
LA07_P: port CS#_DAC4, sheet U_CON_FMC_400PIN/LA.LA07_P  [project net CS#_DAC4]
LA08_N: port CS#_DAC2, sheet U_CON_FMC_400PIN/LA.LA08_N  [project net CS#_DAC2]
LA08_P: port CS#_DAC3, sheet U_CON_FMC_400PIN/LA.LA08_P  [project net CS#_DAC3]
LA09_N: port ATT_B_CH3, sheet U_CON_FMC_400PIN/LA.LA09_N  [project net ATT_B_CH3]
LA09_P: port TERM_CH3, sheet U_CON_FMC_400PIN/LA.LA09_P
LA10_N: port ATT_A_CH4, sheet U_CON_FMC_400PIN/LA.LA10_N  [project net ATT_A_CH4]
LA10_P: port GAIN_A_CH4, sheet U_CON_FMC_400PIN/LA.LA10_P  [project net GAIN_A_CH4]
LA11_N: port TRIG_N, sheet U_CON_FMC_400PIN/LA.LA11_N
LA11_P: port TRIG_P, sheet U_CON_FMC_400PIN/LA.LA11_P
LA12_N: T4.2(G) ; sheet U_CON_FMC_400PIN/LA.LA12_N
LA12_P: port GAIN_B_CH3, sheet U_CON_FMC_400PIN/LA.LA12_P  [project net GAIN_B_CH3]
LA13_N: port STATUS1_FMC, sheet U_CON_FMC_400PIN/LA.LA13_N
LA13_P: port ATT_A_CH3, sheet U_CON_FMC_400PIN/LA.LA13_P  [project net ATT_A_CH3]
LA14_N: port SDIO_CLK_FMC, sheet U_CON_FMC_400PIN/LA.LA14_N
LA14_P: port RESETn_FMC, sheet U_CON_FMC_400PIN/LA.LA14_P
LA15_N: port SCLK_CLK_FMC, sheet U_CON_FMC_400PIN/LA.LA15_N
LA15_P: port STATUS0_FMC, sheet U_CON_FMC_400PIN/LA.LA15_P
LA16_N: port CS_CLK_FMC, sheet U_CON_FMC_400PIN/LA.LA16_N  [project net CS_CLK_FMC]
LA16_P: port REF_SEL_FMC, sheet U_CON_FMC_400PIN/LA.LA16_P
LA17_CC_N: port CLK_FPGA_N, sheet U_CON_FMC_400PIN/LA.LA17_CC_N  [project net CLK_FPGA_N]
LA17_CC_P: port CLK_FPGA_P, sheet U_CON_FMC_400PIN/LA.LA17_CC_P  [project net CLK_FPGA_P]
LA18_CC_N: port FPGA_REF_N, sheet U_CON_FMC_400PIN/LA.LA18_CC_N  [project net FPGA_REF_N]
LA18_CC_P: port FPGA_REF_P, sheet U_CON_FMC_400PIN/LA.LA18_CC_P  [project net FPGA_REF_P]
LA19_N: T7.5(G) ; sheet U_CON_FMC_400PIN/LA.LA19_N
LA19_P: port SDO_CLK_FMC, sheet U_CON_FMC_400PIN/LA.LA19_P
LA22_N: port ATT_B_CH1, sheet U_CON_FMC_400PIN/LA.LA22_N  [project net ATT_B_CH1]
LA22_P: port TRIG_DIR, sheet U_CON_FMC_400PIN/LA.LA22_P
LA23_P: T4.5(G) ; sheet U_CON_FMC_400PIN/LA.LA23_P
LA24_N: port ATT_B_CH2, sheet U_CON_FMC_400PIN/LA.LA24_N  [project net ATT_B_CH2]
LA24_P: port ATT_A_CH2, sheet U_CON_FMC_400PIN/LA.LA24_P  [project net ATT_A_CH2]
LA25_N: port TERM_CH2, sheet U_CON_FMC_400PIN/LA.LA25_N
LA25_P: port GAIN_B_CH2, sheet U_CON_FMC_400PIN/LA.LA25_P  [project net GAIN_B_CH2]
LA26_N: port GAIN_B_CH1, sheet U_CON_FMC_400PIN/LA.LA26_N  [project net GAIN_B_CH1]
LA26_P: port TERM_CH1, sheet U_CON_FMC_400PIN/LA.LA26_P
LA27_N: port TRIG_TERM, sheet U_CON_FMC_400PIN/LA.LA27_N
LA27_P: port GAIN_A_CH1, sheet U_CON_FMC_400PIN/LA.LA27_P  [project net GAIN_A_CH1]
LA28_N: port FD_D_FMC, sheet U_CON_FMC_400PIN/LA.LA28_N  [project net FD_D_FMC]
LA28_P: port FD_A_FMC, sheet U_CON_FMC_400PIN/LA.LA28_P  [project net FD_A_FMC]
LA29_N: port ATT_A_CH1, sheet U_CON_FMC_400PIN/LA.LA29_N  [project net ATT_A_CH1]
LA29_P: port GAIN_A_CH2, sheet U_CON_FMC_400PIN/LA.LA29_P  [project net GAIN_A_CH2]
LA30_N: port SYNCINB1_N, sheet U_CON_FMC_400PIN/LA.LA30_N
LA30_P: port SYNCINB1_P, sheet U_CON_FMC_400PIN/LA.LA30_P
LA31_N: port FD_C_FMC, sheet U_CON_FMC_400PIN/LA.LA31_N  [project net FD_C_FMC]
LA31_P: port CS_ADC2_FMC, sheet U_CON_FMC_400PIN/LA.LA31_P  [project net CS_ADC2_FMC]
LA32_N: port CS_ADC1_FMC, sheet U_CON_FMC_400PIN/LA.LA32_N  [project net CS_ADC1_FMC]
LA32_P: port SDIO_ADC_FMC, sheet U_CON_FMC_400PIN/LA.LA32_P
LA33_N: port SCLK_ADC_FMC, sheet U_CON_FMC_400PIN/LA.LA33_N
LA33_P: port FD_B_FMC, sheet U_CON_FMC_400PIN/LA.LA33_P  [project net FD_B_FMC]
POWER_GOOD: R99.1 T10.1(G) ; port POWER_GOOD
SCL: IC12.6(SCL) ; port SCL, sheet U_CON_FMC_400PIN/I2C.SCL
SDA: IC12.5(SDA) ; port SDA, sheet U_CON_FMC_400PIN/I2C.SDA
TDI: sheet U_CON_FMC_400PIN/JTAG.TDI, sheet U_CON_FMC_400PIN/JTAG.TDO  [also labelled TDO]
NetLD2_1: LD2.1(C) R38.1
NetLD2_3: LD2.3(C) R37.1
NetLD3_1: LD3.1(A) R98.1
NetLD3_2: LD3.2(C) T10.3(D)
NetLD4_1: LD4.1(C) R41.1
NetLD4_3: LD4.3(C) R39.1
NetR37_2: R37.2 T7.6(D)
NetR38_2: R38.2 T7.3(D)
NetR39_2: R39.2 T4.6(D)
NetR41_2: R41.2 T4.3(D)

### Buses and harness runs
bus GA[0..1] = port GA[0..1]

### Layout directives
differential pair: DP0_M2C_N, DP0_M2C_P, DP1_M2C_N, DP1_M2C_P, DP2_M2C_N, DP2_M2C_P, DP3_M2C_N, DP3_M2C_P, DP4_M2C_N, DP4_M2C_P, DP5_M2C_N, DP5_M2C_P, DP6_M2C_N, DP6_M2C_P, DP7_M2C_N, DP7_M2C_P

### Notes on the sheet
- TRIGGER
- CLK
- ADC
- OFFSET
- EEPROM address: b'1010 A2A1A0
- ANALOG INPUT
- Labels drawn without touching a wire or pin: LA20_N, LA20_P, LA21_N, LA21_P, LA23_N
- Title
- Size:
- Date:
- A3
- Number:
- Revision:
- Sheet
- of
- Drawn by:
- File:
- (in symbol KPH-1608CGCK) Green
- (in symbol LED x2 Green 553-0122-300, part A) BOT; Green
- (in symbol LED x2 Green 553-0122-300, part B) TOP; Green
- (in symbol PMGD280UN, part A) 6(D); 2(G); 1(S)
- (in symbol PMGD280UN, part B) 3(D); 5(G); 4(S)
- (in symbol R0402_1k_1%_0.0625W_100PPM) 1%
- (in symbol R0402_330R_1%_0.0625W_100PPM) 1%
- (in symbol R0603_10K_1%_0.1W_100PPM) 1%

### Library data of the parts
C78 = CC0201_100NF_6.3V_10%_X5R: Non-polarised capacitor; Part Description: SMD Multilayer Chip Ceramic Capacitor; Manufacturer: GENERIC; Manufacturer1 Part Number: 02016D104KAT2A; Tolerance: ±10%; Voltage: 6.3V; TC: X5R; Value: 100nF; Part Number: CC0201_100NF_6.3V_10%_X5R; Component Kind: Standard; Component Type: Standard; Pin Count: 2; Status: Not Recommended; Manufacturer Part Number: CC0201_100NF_6.3V_10%_X5R; Case: 0201; Mounted: Yes; Socket: No; SMD: Yes; Sense: No; Manufacturer1 Example: AVX; Manufacturer1 ComponentHeight: 0.33mm; HelpURL: \\cern.ch\dfs\Applications\Altium\Datasheets\CC0201_X5R_AVX.pdf; Author: CERN DEM JLC; CreateDate: 03.12.2007; LatestRevisionDate: 03.12.2007
IC12 = 24AA64T-I/MC: 1.7V-5.5V 64K I2C Serial EEPROM; Part Description: 1.7V-5.5V, 64K  (8K x 8-bit) I2C Serial EEPROM; Manufacturer: MICROCHIP TECHNOLOGY; PressFit: No; Bonding: No; Part Number: 24AA64T-I/MC; Component Kind: Standard; Component Type: Standard; Device: 24AA64T-I/MC; PackageDescription: SON (DFN), 0.50mm pitch, 8 pin, 2mm X 3mm X 1.00mm H body (w/thermal tab 1.75 X 1.55mm),  IPC Medium Density; Manufacturer Part Number: 24AA64T-I/MC; Pin Count: 9; Case: DFN8; Mounted: Yes; Socket: No; SMD: Yes; Sense: No; ComponentHeight: 1mm; HelpURL: \\cern.ch\dfs\Applications\Altium\Datasheets\24AA64T-I-MC.pdf; Author: CERN DEM JLC; CreateDate: 18.11.2009; LatestRevisionDate: 24.01.2011
LD2 LD4 = LED x2 Green 553-0122-300: Manufacturer: Dialight; Manufacturer Part Number: 553-0122-300; ComponentHeight: 9.65mm
LD3 = KPH-1608CGCK: LED Green, SMD 0603; Manufacturer: Kingbright; Manufacturer Part Number: KPH-1608CGCK; ComponentHeight: 0.65mm; HelpURL: http://www.kingbright.com/attachments/file/psearch/000/00/00/KPH-1608CGCK(Ver.20B).pdf; Package Description: SMT Green LED, Case 0603, Body L 1.6 x W 0.8mm H 0.65mm
R37-R39 R41 = R0402_330R_1%_0.0625W_100PPM: Resistor - 1%; Part Description: General Purpose Thick Film Chip Resistor; Manufacturer: GENERIC; Manufacturer1 Part Number: 232270673301L; TC: ±100ppm/°C; Part Number: R0402_330R_1%_0.0625W_100PPM; Component Kind: Standard; Component Type: Standard; Pin Count: 2; Value: 330; Status: Not recommended; Power: 0.0625W; Tolerance: ±1%; Manufacturer Part Number: R0402_330R_1%_0.0625W_100PPM; Case: 0402; Mounted: Yes; Sense: No; Socket: No; SMD: Yes; Manufacturer1 Example: YAGEO PHYCOMP; Manufacturer1 ComponentHeight: 0.4mm; HelpURL: \\cern.ch\dfs\Applications\Altium\Datasheets\R0402_Phycomp_RC0402.pdf; Author: CERN DEM JLC; CreateDate: 03.12.2007; LatestRevisionDate: 17.10.2012
R98 = R0402_1k_1%_0.0625W_100PPM: Resistor - 1%; Part Description: General Purpose Thick Film Chip Resistor; Manufacturer: GENERIC; Manufacturer1 Part Number: 232270671002L; TC: ±100ppm/°C; PressFit: No; Part Number: R0402_1K_1%_0.0625W_100PPM; Component Kind: Standard; Component Type: Standard; Pin Count: 2; Value: 1k; Status: Not Recommended; Power: 0.0625W; Tolerance: ±1%; Manufacturer Part Number: R0402_1K_1%_0.0625W_100PPM; Case: 0402; Mounted: Yes; Sense: No; Socket: No; SMD: Yes; Manufacturer1 Example: YAGEO PHYCOMP; Manufacturer1 ComponentHeight: 0.4mm; HelpURL: \\cern.ch\dfs\Applications\Altium\Datasheets\R0402_Phycomp_RC0402.pdf; Author: CERN DEM JLC; CreateDate: 03.12.2007; LatestRevisionDate: 17.10.2012
R99 = R0603_10K_1%_0.1W_100PPM: Resistor - 1%; Part Description: General Purpose Thick Film Chip Resistor; Manufacturer: GENERIC; Manufacturer1 Part Number: NRC06F1002TRF; Power: 0.1W; TC: ±100ppm/°C; Part Number: R0603_10K_1%_0.1W_100PPM; Component Kind: Standard; Component Type: Standard; Pin Count: 2; Value: 10k; Status: Preferred; Tolerance: ±1%; Manufacturer Part Number: R0603_10K_1%_0.1W_100PPM; Case: 0603; Mounted: Yes; Sense: No; Socket: No; SMD: Yes; Manufacturer1 Example: NIC COMPONENT; Manufacturer1 ComponentHeight: 0.55mm; HelpURL: \\cern.ch\dfs\Applications\Altium\Datasheets\R0603_NIC_NRC.pdf; Author: CERN DEM JLC; CreateDate: 03.12.2007; LatestRevisionDate: 13.03.2008
T4 T7 = PMGD280UN: Dual N-Channel micro TrenchMOS™ Ultra Low Level FET; Part Description: 20V 870mA Dual N-Channel micro TrenchMOS™ Ultra Low Level FET; Manufacturer: NXP SEMICONDUCTORS; PressFit: No; Bonding: No; Part Number: PMGD280UN; Component Kind: Standard; Component Type: Standard; Device: PMGD280UN; PackageDescription: SOT363, SC70-6, SOT, 0.65mm Pitch, 6 pin, 1.25mm W X 2.00mm L X 1.10mm H, IPC Medium Density; Manufacturer Part Number: PMGD280UN; Pin Count: 6; Case: SOT363; Mounted: Yes; Socket: No; SMD: Yes; Sense: No; ComponentHeight: 1.1mm; HelpURL: \\cern.ch\dfs\Applications\Altium\Datasheets\PMGD280UN.pdf; Author: CERN DEM JLC; CreateDate: 19.11.2014; LatestRevisionDate: 19.11.2014
T10 = BSH103: N-CHANNEL MOSFET WITH DIODE; Part Description: 30V 850mA N-Channel Enhancement Mode Field-Effect Transistor; Manufacturer: NEXPERIA; PressFit: No; Bonding: No; Part Number: BSH103; Component Kind: Standard; Component Type: Standard; Device: BSH103; PackageDescription: SOT23, 3 pin, Pitch 0.95mm - 1.3mm W X 2.9mm L X 1.1mm H, IPC Medium Density; Manufacturer Part Number: BSH103; Pin Count: 3; Case: SOT23-3; Mounted: Yes; Socket: No; SMD: Yes; Sense: No; ComponentHeight: 1.1mm; HelpURL: \\cern.ch\dfs\Applications\Altium\Datasheets\BSH103.pdf; Author: CERN DEM JLC; CreateDate: 16.03.2010; LatestRevisionDate: 20.06.2017

## Sheet CON_FMC_400PIN.SchDoc: FMC Connector
size A3; Author: Wojciech Ruc³o; Organization: Warsaw Univeristy of Technology; Address1: Nowowiejska 15/19; DocumentNumber: 12; Revision: 1.0; SheetNumber: 12; SheetTotal: 12
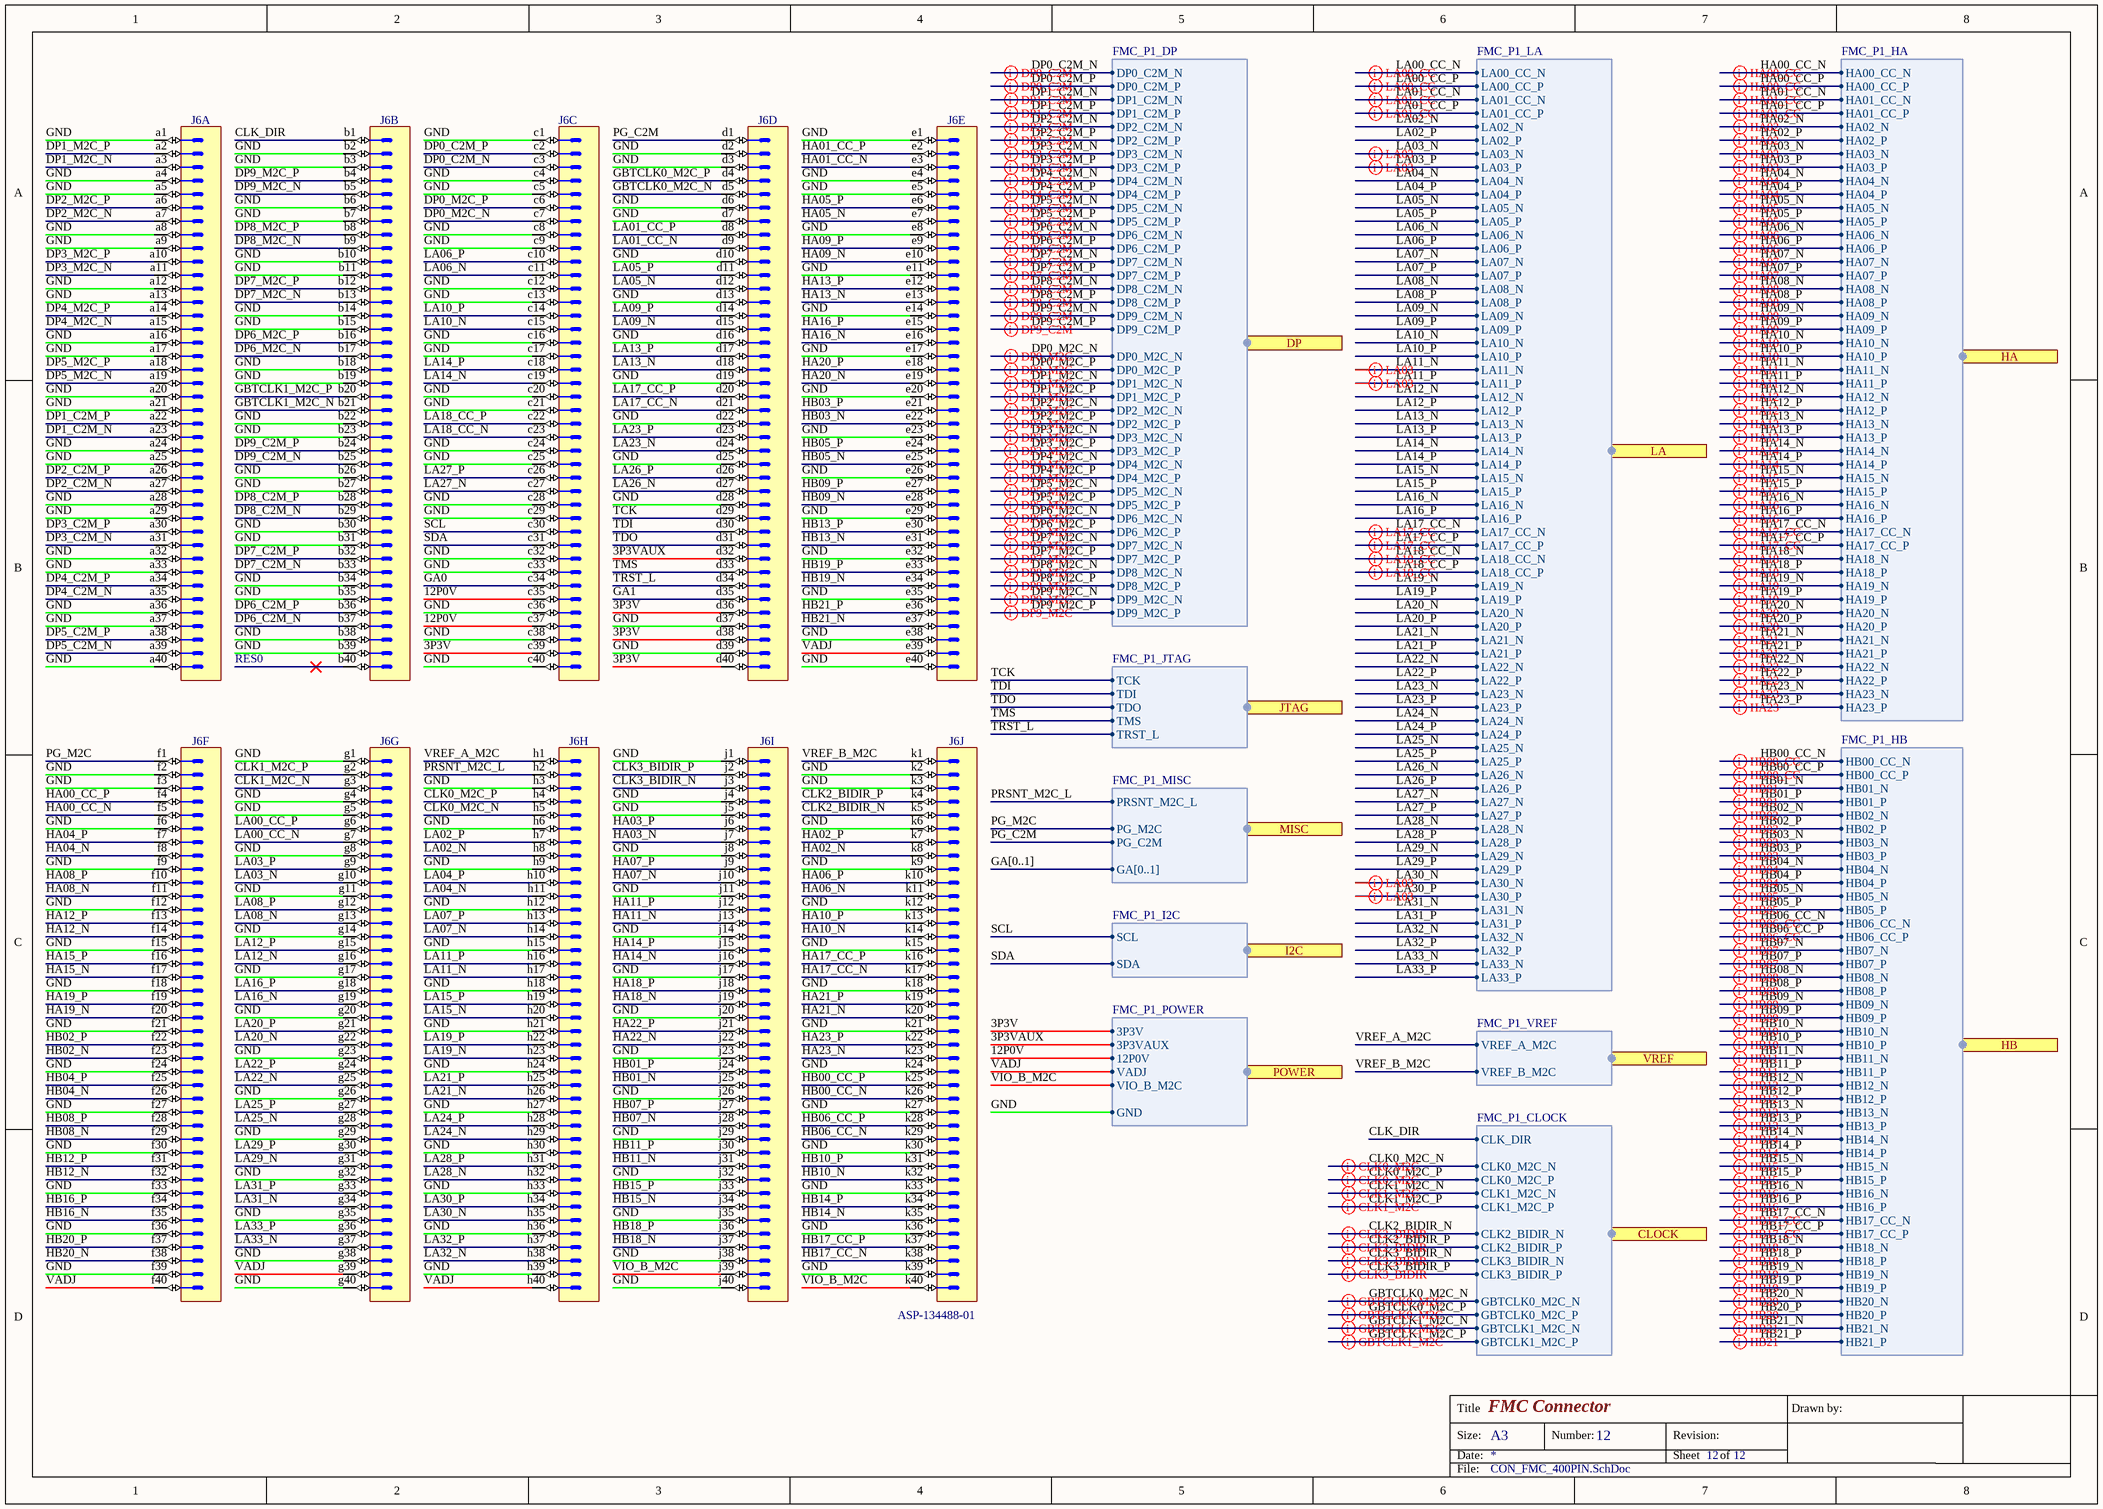
[diagram p2: CON_FMC_400PIN.SchDoc]

### Parts
J6  ASP-134488-01  [SAMTEC_ASP-134488-01]  (parts A,B,C,D,E,F,G,H,I,J of 10)

### Ports
CLOCK (harness FMC_P1_CLOCK), DP (harness FMC_P1_DP), HA (harness FMC_P1_HA), HB (harness FMC_P1_HB), I2C (harness FMC_P1_I2C), JTAG (harness FMC_P1_JTAG), LA (harness FMC_P1_LA), MISC (harness FMC_P1_MISC), POWER (harness FMC_P1_POWER), VREF (harness FMC_P1_VREF)

### Harnesses
FMC_P1_LA: LA05_N, LA05_P, LA06_N, LA06_P, LA09_N, LA09_P, LA10_N, LA10_P, LA13_N, LA13_P, LA14_N, LA14_P, LA23_N, LA23_P, LA26_N, LA26_P, LA27_N, LA27_P, LA02_N, LA02_P, LA03_N, LA03_P, LA04_N, LA04_P, LA07_N, LA07_P, LA08_N, LA08_P, LA11_N, LA11_P, LA12_N, LA12_P, LA15_N, LA15_P, LA16_N, LA16_P, LA19_N, LA19_P, LA20_N, LA20_P, LA21_N, LA21_P, LA22_N, LA22_P, LA24_N, LA24_P, LA25_N, LA25_P, LA28_N, LA28_P, LA29_N, LA29_P, LA30_N, LA30_P, LA31_N, LA31_P, LA32_N, LA32_P, LA33_N, LA33_P, LA00_CC_N, LA00_CC_P, LA01_CC_N, LA01_CC_P, LA17_CC_N, LA17_CC_P, LA18_CC_N, LA18_CC_P
FMC_P1_HA: HA04_N, HA04_P, HA05_N, HA05_P, HA08_N, HA08_P, HA09_N, HA09_P, HA12_N, HA12_P, HA13_N, HA13_P, HA15_N, HA15_P, HA16_N, HA16_P, HA19_N, HA19_P, HA20_N, HA20_P, HA02_N, HA02_P, HA03_N, HA03_P, HA06_N, HA06_P, HA07_N, HA07_P, HA10_N, HA10_P, HA11_N, HA11_P, HA14_N, HA14_P, HA18_N, HA18_P, HA21_N, HA21_P, HA22_N, HA22_P, HA23_N, HA23_P, HA17_CC_N, HA17_CC_P, HA00_CC_N, HA00_CC_P, HA01_CC_N, HA01_CC_P
FMC_P1_HB: HB02_N, HB02_P, HB03_N, HB03_P, HB04_N, HB04_P, HB05_N, HB05_P, HB08_N, HB08_P, HB09_N, HB09_P, HB12_N, HB12_P, HB13_N, HB13_P, HB16_N, HB16_P, HB19_N, HB19_P, HB20_N, HB20_P, HB21_N, HB21_P, HB01_N, HB01_P, HB07_N, HB07_P, HB10_N, HB10_P, HB11_N, HB11_P, HB14_N, HB14_P, HB15_N, HB15_P, HB18_N, HB18_P, HB17_CC_N, HB17_CC_P, HB06_CC_N, HB06_CC_P, HB00_CC_N, HB00_CC_P
FMC_P1_MISC: PRSNT_M2C_L, PG_M2C, PG_C2M, GA[0..1]
FMC_P1_POWER: 3P3V, 3P3VAUX, 12P0V, VADJ, VIO_B_M2C, GND
FMC_P1_JTAG: TCK, TDI, TDO, TMS, TRST_L
FMC_P1_I2C: SCL, SDA
FMC_P1_CLOCK: CLK2_BIDIR_N, CLK2_BIDIR_P, CLK3_BIDIR_N, CLK3_BIDIR_P, CLK0_M2C_N, CLK0_M2C_P, CLK1_M2C_N, CLK1_M2C_P, CLK_DIR, GBTCLK0_M2C_N, GBTCLK0_M2C_P, GBTCLK1_M2C_N, GBTCLK1_M2C_P
FMC_P1_VREF: VREF_A_M2C, VREF_B_M2C
FMC_P1_DP: DP1_C2M_N, DP1_C2M_P, DP1_M2C_N, DP1_M2C_P, DP2_C2M_N, DP2_C2M_P, DP2_M2C_N, DP2_M2C_P, DP3_C2M_N, DP3_C2M_P, DP3_M2C_N, DP3_M2C_P, DP4_C2M_N, DP4_C2M_P, DP4_M2C_N, DP4_M2C_P, DP5_C2M_N, DP5_C2M_P, DP5_M2C_N, DP5_M2C_P, DP6_C2M_N, DP6_C2M_P, DP6_M2C_N, DP6_M2C_P, DP7_C2M_N, DP7_C2M_P, DP7_M2C_N, DP7_M2C_P, DP8_C2M_N, DP8_C2M_P, DP8_M2C_N, DP8_M2C_P, DP9_C2M_N, DP9_C2M_P, DP9_M2C_N, DP9_M2C_P, DP0_C2M_N, DP0_C2M_P, DP0_M2C_N, DP0_M2C_P

### Nets
3P3V: J6.c39 J6.d36 J6.d38 J6.d40 ; port POWER.3P3V
3P3VAUX: J6.d32 ; port POWER.3P3VAUX
12P0V: J6.c35 J6.c37 ; port POWER.12P0V
GND: J6.a1 J6.a4 J6.a5 J6.a8 J6.a9 J6.a12 J6.a13 J6.a16 J6.a17 J6.a20 J6.a21 J6.a24 J6.a25 J6.a28 J6.a29 J6.a32 J6.a33 J6.a36 J6.a37 J6.a40 J6.b2 J6.b3 J6.b6 J6.b7 J6.b10 J6.b11 J6.b14 J6.b15 J6.b18 J6.b19 J6.b22 J6.b23 J6.b26 J6.b27 J6.b30 J6.b31 J6.b34 J6.b35 J6.b38 J6.b39 J6.c1 J6.c4 J6.c5 J6.c8 J6.c9 J6.c12 J6.c13 J6.c16 J6.c17 J6.c20 J6.c21 J6.c24 J6.c25 J6.c28 J6.c29 J6.c32 J6.c33 J6.c36 J6.c38 J6.c40 J6.d2 J6.d3 J6.d6 J6.d7 J6.d10 J6.d13 J6.d16 J6.d19 J6.d22 J6.d25 J6.d28 J6.d37 J6.d39 J6.e1 J6.e4 J6.e5 J6.e8 J6.e11 J6.e14 J6.e17 J6.e20 J6.e23 J6.e26 J6.e29 J6.e32 J6.e35 J6.e38 J6.e40 J6.f2 J6.f3 J6.f6 J6.f9 J6.f12 J6.f15 J6.f18 J6.f21 J6.f24 J6.f27 J6.f30 J6.f33 J6.f36 J6.f39 J6.g1 J6.g4 J6.g5 J6.g8 J6.g11 J6.g14 J6.g17 J6.g20 J6.g23 J6.g26 J6.g29 J6.g32 J6.g35 J6.g38 J6.g40 J6.h2 J6.h3 J6.h6 J6.h9 J6.h12 J6.h15 J6.h18 J6.h21 J6.h24 J6.h27 J6.h30 J6.h33 J6.h36 J6.h39 J6.j1 J6.j4 J6.j5 J6.j8 J6.j11 J6.j14 J6.j17 J6.j20 J6.j23 J6.j26 J6.j29 J6.j32 J6.j35 J6.j38 J6.j40 J6.k2 J6.k3 J6.k6 J6.k9 J6.k12 J6.k15 J6.k18 J6.k21 J6.k24 J6.k27 J6.k30 J6.k33 J6.k36 J6.k39 ; port MISC.PRSNT_M2C_L, port POWER.GND  [also labelled PRSNT_M2C_L]
VADJ: J6.e39 J6.f40 J6.g39 J6.h40 ; port POWER.VADJ
CLK0_M2C_N: J6.h5 ; port CLOCK.CLK0_M2C_N
CLK0_M2C_P: J6.h4 ; port CLOCK.CLK0_M2C_P
CLK1_M2C_N: J6.g3 ; port CLOCK.CLK1_M2C_N
CLK1_M2C_P: J6.g2 ; port CLOCK.CLK1_M2C_P
CLK2_BIDIR_N: J6.k5 ; port CLOCK.CLK2_BIDIR_N
CLK2_BIDIR_P: J6.k4 ; port CLOCK.CLK2_BIDIR_P
CLK3_BIDIR_N: J6.j3 ; port CLOCK.CLK3_BIDIR_N
CLK3_BIDIR_P: J6.j2 ; port CLOCK.CLK3_BIDIR_P
CLK_DIR: J6.b1 ; port CLOCK.CLK_DIR
DP0_C2M_N: J6.c3 ; port DP.DP0_C2M_N
DP0_C2M_P: J6.c2 ; port DP.DP0_C2M_P
DP0_M2C_N: J6.c7 ; port DP.DP0_M2C_N
DP0_M2C_P: J6.c6 ; port DP.DP0_M2C_P
DP1_C2M_N: J6.a23 ; port DP.DP1_C2M_N
DP1_C2M_P: J6.a22 ; port DP.DP1_C2M_P
DP1_M2C_N: J6.a3 ; port DP.DP1_M2C_N
DP1_M2C_P: J6.a2 ; port DP.DP1_M2C_P
DP2_C2M_N: J6.a27 ; port DP.DP2_C2M_N
DP2_C2M_P: J6.a26 ; port DP.DP2_C2M_P
DP2_M2C_N: J6.a7 ; port DP.DP2_M2C_N
DP2_M2C_P: J6.a6 ; port DP.DP2_M2C_P
DP3_C2M_N: J6.a31 ; port DP.DP3_C2M_N
DP3_C2M_P: J6.a30 ; port DP.DP3_C2M_P
DP3_M2C_N: J6.a11 ; port DP.DP3_M2C_N
DP3_M2C_P: J6.a10 ; port DP.DP3_M2C_P
DP4_C2M_N: J6.a35 ; port DP.DP4_C2M_N
DP4_C2M_P: J6.a34 ; port DP.DP4_C2M_P
DP4_M2C_N: J6.a15 ; port DP.DP4_M2C_N
DP4_M2C_P: J6.a14 ; port DP.DP4_M2C_P
DP5_C2M_N: J6.a39 ; port DP.DP5_C2M_N
DP5_C2M_P: J6.a38 ; port DP.DP5_C2M_P
DP5_M2C_N: J6.a19 ; port DP.DP5_M2C_N
DP5_M2C_P: J6.a18 ; port DP.DP5_M2C_P
DP6_C2M_N: J6.b37 ; port DP.DP6_C2M_N
DP6_C2M_P: J6.b36 ; port DP.DP6_C2M_P
DP6_M2C_N: J6.b17 ; port DP.DP6_M2C_N
DP6_M2C_P: J6.b16 ; port DP.DP6_M2C_P
DP7_C2M_N: J6.b33 ; port DP.DP7_C2M_N
DP7_C2M_P: J6.b32 ; port DP.DP7_C2M_P
DP7_M2C_N: J6.b13 ; port DP.DP7_M2C_N
DP7_M2C_P: J6.b12 ; port DP.DP7_M2C_P
DP8_C2M_N: J6.b29 ; port DP.DP8_C2M_N
DP8_C2M_P: J6.b28 ; port DP.DP8_C2M_P
DP8_M2C_N: J6.b9 ; port DP.DP8_M2C_N
DP8_M2C_P: J6.b8 ; port DP.DP8_M2C_P
DP9_C2M_N: J6.b25 ; port DP.DP9_C2M_N
DP9_C2M_P: J6.b24 ; port DP.DP9_C2M_P
DP9_M2C_N: J6.b5 ; port DP.DP9_M2C_N
DP9_M2C_P: J6.b4 ; port DP.DP9_M2C_P
GA0: J6.c34
GA1: J6.d35
GBTCLK0_M2C_N: J6.d5 ; port CLOCK.GBTCLK0_M2C_N  [project net CLK_MGT_N]
GBTCLK0_M2C_P: J6.d4 ; port CLOCK.GBTCLK0_M2C_P  [project net CLK_MGT_P]
GBTCLK1_M2C_N: J6.b21 ; port CLOCK.GBTCLK1_M2C_N
GBTCLK1_M2C_P: J6.b20 ; port CLOCK.GBTCLK1_M2C_P
HA00_CC_N: J6.f5 ; port HA.HA00_CC_N
HA00_CC_P: J6.f4 ; port HA.HA00_CC_P
HA01_CC_N: J6.e3 ; port HA.HA01_CC_N
HA01_CC_P: J6.e2 ; port HA.HA01_CC_P
HA02_N: J6.k8 ; port HA.HA02_N
HA02_P: J6.k7 ; port HA.HA02_P
HA03_N: J6.j7 ; port HA.HA03_N
HA03_P: J6.j6 ; port HA.HA03_P
HA04_N: J6.f8 ; port HA.HA04_N
HA04_P: J6.f7 ; port HA.HA04_P
HA05_N: J6.e7 ; port HA.HA05_N
HA05_P: J6.e6 ; port HA.HA05_P
HA06_N: J6.k11 ; port HA.HA06_N
HA06_P: J6.k10 ; port HA.HA06_P
HA07_N: J6.j10 ; port HA.HA07_N
HA07_P: J6.j9 ; port HA.HA07_P
HA08_N: J6.f11 ; port HA.HA08_N
HA08_P: J6.f10 ; port HA.HA08_P
HA09_N: J6.e10 ; port HA.HA09_N
HA09_P: J6.e9 ; port HA.HA09_P
HA10_N: J6.k14 ; port HA.HA10_N
HA10_P: J6.k13 ; port HA.HA10_P
HA11_N: J6.j13 ; port HA.HA11_N
HA11_P: J6.j12 ; port HA.HA11_P
HA12_N: J6.f14 ; port HA.HA12_N
HA12_P: J6.f13 ; port HA.HA12_P
HA13_N: J6.e13 ; port HA.HA13_N
HA13_P: J6.e12 ; port HA.HA13_P
HA14_N: J6.j16 ; port HA.HA14_N
HA14_P: J6.j15 ; port HA.HA14_P
HA15_N: J6.f17 ; port HA.HA15_N
HA15_P: J6.f16 ; port HA.HA15_P
HA16_N: J6.e16 ; port HA.HA16_N
HA16_P: J6.e15 ; port HA.HA16_P
HA17_CC_N: J6.k17 ; port HA.HA17_CC_N
HA17_CC_P: J6.k16 ; port HA.HA17_CC_P
HA18_N: J6.j19 ; port HA.HA18_N
HA18_P: J6.j18 ; port HA.HA18_P
HA19_N: J6.f20 ; port HA.HA19_N
HA19_P: J6.f19 ; port HA.HA19_P
HA20_N: J6.e19 ; port HA.HA20_N
HA20_P: J6.e18 ; port HA.HA20_P
HA21_N: J6.k20 ; port HA.HA21_N
HA21_P: J6.k19 ; port HA.HA21_P
HA22_N: J6.j22 ; port HA.HA22_N
HA22_P: J6.j21 ; port HA.HA22_P
HA23_N: J6.k23 ; port HA.HA23_N
HA23_P: J6.k22 ; port HA.HA23_P
HB00_CC_N: J6.k26 ; port HB.HB00_CC_N
HB00_CC_P: J6.k25 ; port HB.HB00_CC_P
HB01_N: J6.j25 ; port HB.HB01_N
HB01_P: J6.j24 ; port HB.HB01_P
HB02_N: J6.f23 ; port HB.HB02_N
HB02_P: J6.f22 ; port HB.HB02_P
HB03_N: J6.e22 ; port HB.HB03_N
HB03_P: J6.e21 ; port HB.HB03_P
HB04_N: J6.f26 ; port HB.HB04_N
HB04_P: J6.f25 ; port HB.HB04_P
HB05_N: J6.e25 ; port HB.HB05_N
HB05_P: J6.e24 ; port HB.HB05_P
HB06_CC_N: J6.k29 ; port HB.HB06_CC_N
HB06_CC_P: J6.k28 ; port HB.HB06_CC_P
HB07_N: J6.j28 ; port HB.HB07_N
HB07_P: J6.j27 ; port HB.HB07_P
HB08_N: J6.f29 ; port HB.HB08_N
HB08_P: J6.f28 ; port HB.HB08_P
HB09_N: J6.e28 ; port HB.HB09_N
HB09_P: J6.e27 ; port HB.HB09_P
HB10_N: J6.k32 ; port HB.HB10_N
HB10_P: J6.k31 ; port HB.HB10_P
HB11_N: J6.j31 ; port HB.HB11_N
HB11_P: J6.j30 ; port HB.HB11_P
HB12_N: J6.f32 ; port HB.HB12_N
HB12_P: J6.f31 ; port HB.HB12_P
HB13_N: J6.e31 ; port HB.HB13_N
HB13_P: J6.e30 ; port HB.HB13_P
HB14_N: J6.k35 ; port HB.HB14_N
HB14_P: J6.k34 ; port HB.HB14_P
HB15_N: J6.j34 ; port HB.HB15_N
HB15_P: J6.j33 ; port HB.HB15_P
HB16_N: J6.f35 ; port HB.HB16_N
HB16_P: J6.f34 ; port HB.HB16_P
HB17_CC_N: J6.k38 ; port HB.HB17_CC_N
HB17_CC_P: J6.k37 ; port HB.HB17_CC_P
HB18_N: J6.j37 ; port HB.HB18_N
HB18_P: J6.j36 ; port HB.HB18_P
HB19_N: J6.e34 ; port HB.HB19_N
HB19_P: J6.e33 ; port HB.HB19_P
HB20_N: J6.f38 ; port HB.HB20_N
HB20_P: J6.f37 ; port HB.HB20_P
HB21_N: J6.e37 ; port HB.HB21_N
HB21_P: J6.e36 ; port HB.HB21_P
LA00_CC_N: J6.g7 ; port LA.LA00_CC_N
LA00_CC_P: J6.g6 ; port LA.LA00_CC_P
LA01_CC_N: J6.d9 ; port LA.LA01_CC_N
LA01_CC_P: J6.d8 ; port LA.LA01_CC_P
LA02_N: J6.h8 ; port LA.LA02_N  [project net DIN_DACS]
LA02_P: J6.h7 ; port LA.LA02_P
LA03_N: J6.g10 ; port LA.LA03_N
LA03_P: J6.g9 ; port LA.LA03_P
LA04_N: J6.h11 ; port LA.LA04_N  [project net CS#_DAC1]
LA04_P: J6.h10 ; port LA.LA04_P  [project net CLR#_DACS]
LA05_N: J6.d12 ; port LA.LA05_N  [project net GAIN_B_CH4]
LA05_P: J6.d11 ; port LA.LA05_P  [project net ATT_B_CH4]
LA06_N: J6.c11 ; port LA.LA06_N
LA06_P: J6.c10 ; port LA.LA06_P
LA07_N: J6.h14 ; port LA.LA07_N  [project net GAIN_A_CH3]
LA07_P: J6.h13 ; port LA.LA07_P  [project net CS#_DAC4]
LA08_N: J6.g13 ; port LA.LA08_N  [project net CS#_DAC2]
LA08_P: J6.g12 ; port LA.LA08_P  [project net CS#_DAC3]
LA09_N: J6.d15 ; port LA.LA09_N  [project net ATT_B_CH3]
LA09_P: J6.d14 ; port LA.LA09_P
LA10_N: J6.c15 ; port LA.LA10_N  [project net ATT_A_CH4]
LA10_P: J6.c14 ; port LA.LA10_P  [project net GAIN_A_CH4]
LA11_N: J6.h17 ; port LA.LA11_N
LA11_P: J6.h16 ; port LA.LA11_P
LA12_N: J6.g16 ; port LA.LA12_N
LA12_P: J6.g15 ; port LA.LA12_P  [project net GAIN_B_CH3]
LA13_N: J6.d18 ; port LA.LA13_N
LA13_P: J6.d17 ; port LA.LA13_P  [project net ATT_A_CH3]
LA14_N: J6.c19 ; port LA.LA14_N
LA14_P: J6.c18 ; port LA.LA14_P
LA15_N: J6.h20 ; port LA.LA15_N
LA15_P: J6.h19 ; port LA.LA15_P
LA16_N: J6.g19 ; port LA.LA16_N  [project net CS_CLK_FMC]
LA16_P: J6.g18 ; port LA.LA16_P
LA17_CC_N: J6.d21 ; port LA.LA17_CC_N  [project net CLK_FPGA_N]
LA17_CC_P: J6.d20 ; port LA.LA17_CC_P  [project net CLK_FPGA_P]
LA18_CC_N: J6.c23 ; port LA.LA18_CC_N  [project net FPGA_REF_N]
LA18_CC_P: J6.c22 ; port LA.LA18_CC_P  [project net FPGA_REF_P]
LA19_N: J6.h23 ; port LA.LA19_N
LA19_P: J6.h22 ; port LA.LA19_P
LA20_N: J6.g22 ; port LA.LA20_N
LA20_P: J6.g21 ; port LA.LA20_P
LA21_N: J6.h26 ; port LA.LA21_N
LA21_P: J6.h25 ; port LA.LA21_P
LA22_N: J6.g25 ; port LA.LA22_N  [project net ATT_B_CH1]
LA22_P: J6.g24 ; port LA.LA22_P
LA23_N: J6.d24 ; port LA.LA23_N
LA23_P: J6.d23 ; port LA.LA23_P
LA24_N: J6.h29 ; port LA.LA24_N  [project net ATT_B_CH2]
LA24_P: J6.h28 ; port LA.LA24_P  [project net ATT_A_CH2]
LA25_N: J6.g28 ; port LA.LA25_N
LA25_P: J6.g27 ; port LA.LA25_P  [project net GAIN_B_CH2]
LA26_N: J6.d27 ; port LA.LA26_N  [project net GAIN_B_CH1]
LA26_P: J6.d26 ; port LA.LA26_P
LA27_N: J6.c27 ; port LA.LA27_N
LA27_P: J6.c26 ; port LA.LA27_P  [project net GAIN_A_CH1]
LA28_N: J6.h32 ; port LA.LA28_N  [project net FD_D_FMC]
LA28_P: J6.h31 ; port LA.LA28_P  [project net FD_A_FMC]
LA29_N: J6.g31 ; port LA.LA29_N  [project net ATT_A_CH1]
LA29_P: J6.g30 ; port LA.LA29_P  [project net GAIN_A_CH2]
LA30_N: J6.h35 ; port LA.LA30_N
LA30_P: J6.h34 ; port LA.LA30_P
LA31_N: J6.g34 ; port LA.LA31_N  [project net FD_C_FMC]
LA31_P: J6.g33 ; port LA.LA31_P  [project net CS_ADC2_FMC]
LA32_N: J6.h38 ; port LA.LA32_N  [project net CS_ADC1_FMC]
LA32_P: J6.h37 ; port LA.LA32_P
LA33_N: J6.g37 ; port LA.LA33_N
LA33_P: J6.g36 ; port LA.LA33_P  [project net FD_B_FMC]
PG_C2M: J6.d1 ; port MISC.PG_C2M
PG_M2C: J6.f1 ; port MISC.PG_M2C
SCL: J6.c30 ; port I2C.SCL
SDA: J6.c31 ; port I2C.SDA
TCK: J6.d29 ; port JTAG.TCK
TDI: J6.d30 J6.d31 ; port JTAG.TDI, port JTAG.TDO  [also labelled TDO]
TMS: J6.d33 ; port JTAG.TMS
TRST_L: J6.d34 ; port JTAG.TRST_L
VIO_B_M2C: J6.j39 J6.k40 ; port POWER.VIO_B_M2C
VREF_A_M2C: J6.h1 ; port VREF.VREF_A_M2C
VREF_B_M2C: J6.k1 ; port VREF.VREF_B_M2C

Not connected (* = marked no-connect by the designer): J6 b40*

### Buses and harness runs
bus GA[0..1]

### Layout directives
differential pair: CLK0_M2C_N, CLK0_M2C_P, CLK1_M2C_N, CLK1_M2C_P, CLK2_BIDIR_N, CLK2_BIDIR_P, CLK3_BIDIR_N, CLK3_BIDIR_P, CLK_FPGA_N, CLK_FPGA_P, CLK_MGT_N, CLK_MGT_P, DP0_C2M_N, DP0_C2M_P, DP0_M2C_N, DP0_M2C_P, DP1_C2M_N, DP1_C2M_P, DP1_M2C_N, DP1_M2C_P, DP2_C2M_N, DP2_C2M_P, DP2_M2C_N, DP2_M2C_P, DP3_C2M_N, DP3_C2M_P, DP3_M2C_N, DP3_M2C_P, DP4_C2M_N, DP4_C2M_P, DP4_M2C_N, DP4_M2C_P, DP5_C2M_N, DP5_C2M_P, DP5_M2C_N, DP5_M2C_P, DP6_C2M_N, DP6_C2M_P, DP6_M2C_N, DP6_M2C_P, DP7_C2M_N, DP7_C2M_P, DP7_M2C_N, DP7_M2C_P, DP8_C2M_N, DP8_C2M_P, DP8_M2C_N, DP8_M2C_P, DP9_C2M_N, DP9_C2M_P, DP9_M2C_N, DP9_M2C_P, FPGA_REF_N, FPGA_REF_P, GBTCLK1_M2C_N, GBTCLK1_M2C_P, HA00_CC_N, HA00_CC_P, HA01_CC_N, HA01_CC_P, HA02_N, HA02_P, HA03_N, HA03_P, HA04_N, HA04_P, HA05_N, HA05_P, HA06_N, HA06_P, HA07_N, HA07_P, HA08_N, HA08_P, HA09_N, HA09_P, HA10_N, HA10_P, HA11_N, HA11_P, HA12_N, HA12_P, HA13_N, HA13_P, HA14_N, HA14_P, HA15_N, HA15_P, HA16_N, HA16_P, HA17_CC_N, HA17_CC_P, HA18_N, HA18_P, HA19_N, HA19_P, HA20_N, HA20_P, HA21_N, HA21_P, HA22_N, HA22_P, HA23_N, HA23_P, HB00_CC_N, HB00_CC_P, HB01_N, HB01_P, HB02_N, HB02_P, HB03_N, HB03_P, HB04_N, HB04_P, HB05_N, HB05_P, HB06_CC_N, HB06_CC_P, HB07_N, HB07_P, HB08_N, HB08_P, HB09_N, HB09_P, HB10_N, HB10_P, HB11_N, HB11_P, HB12_N, HB12_P, HB13_N, HB13_P, HB14_N, HB14_P, HB15_N, HB15_P, HB16_N, HB16_P, HB17_CC_N, HB17_CC_P, HB18_N, HB18_P, HB19_N, HB19_P, HB20_N, HB20_P, HB21_N, HB21_P, LA00_CC_N, LA00_CC_P, LA01_CC_N, LA01_CC_P, LA03_N, LA03_P, LA11_N, LA11_P, LA30_N, LA30_P

### Notes on the sheet
- RES0
- Title
- Size:
- Date:
- A3
- Number:
- Revision:
- Sheet
- of
- Drawn by:
- File:

### Library data of the parts
J6 = SAMTEC_ASP-134488-01: Connector VITA 57, 400 Male contacts in 10 row abcdefghj; Part Description: 400 contacts (10 rows abcdefghj) Surface Mount Male Connector, VITA 57 (MC-HPC-10); Manufacturer: SAMTEC; PressFit: No; Part Number: SAMTEC_ASP-134488-01; Component Kind: Standard; Component Type: Standard; Pin Count: 400; Family: VITA 57; Mounted: Yes; Socket: No; Sense: No; SMD: Yes; Status: None; Manufacturer Part Number: ASP-134488-01; ComponentHeight: 6.1mm; HelpURL: \\cern.ch\dfs\Applications\Altium\Datasheets\SAMTEC_ASP-134488-01.pdf; Author: CERN DEM JLC; CreateDate: 30.04.2009; LatestRevisionDate: 17.08.2009